# EAGLE design shématic (EAGLE 9.5.2)
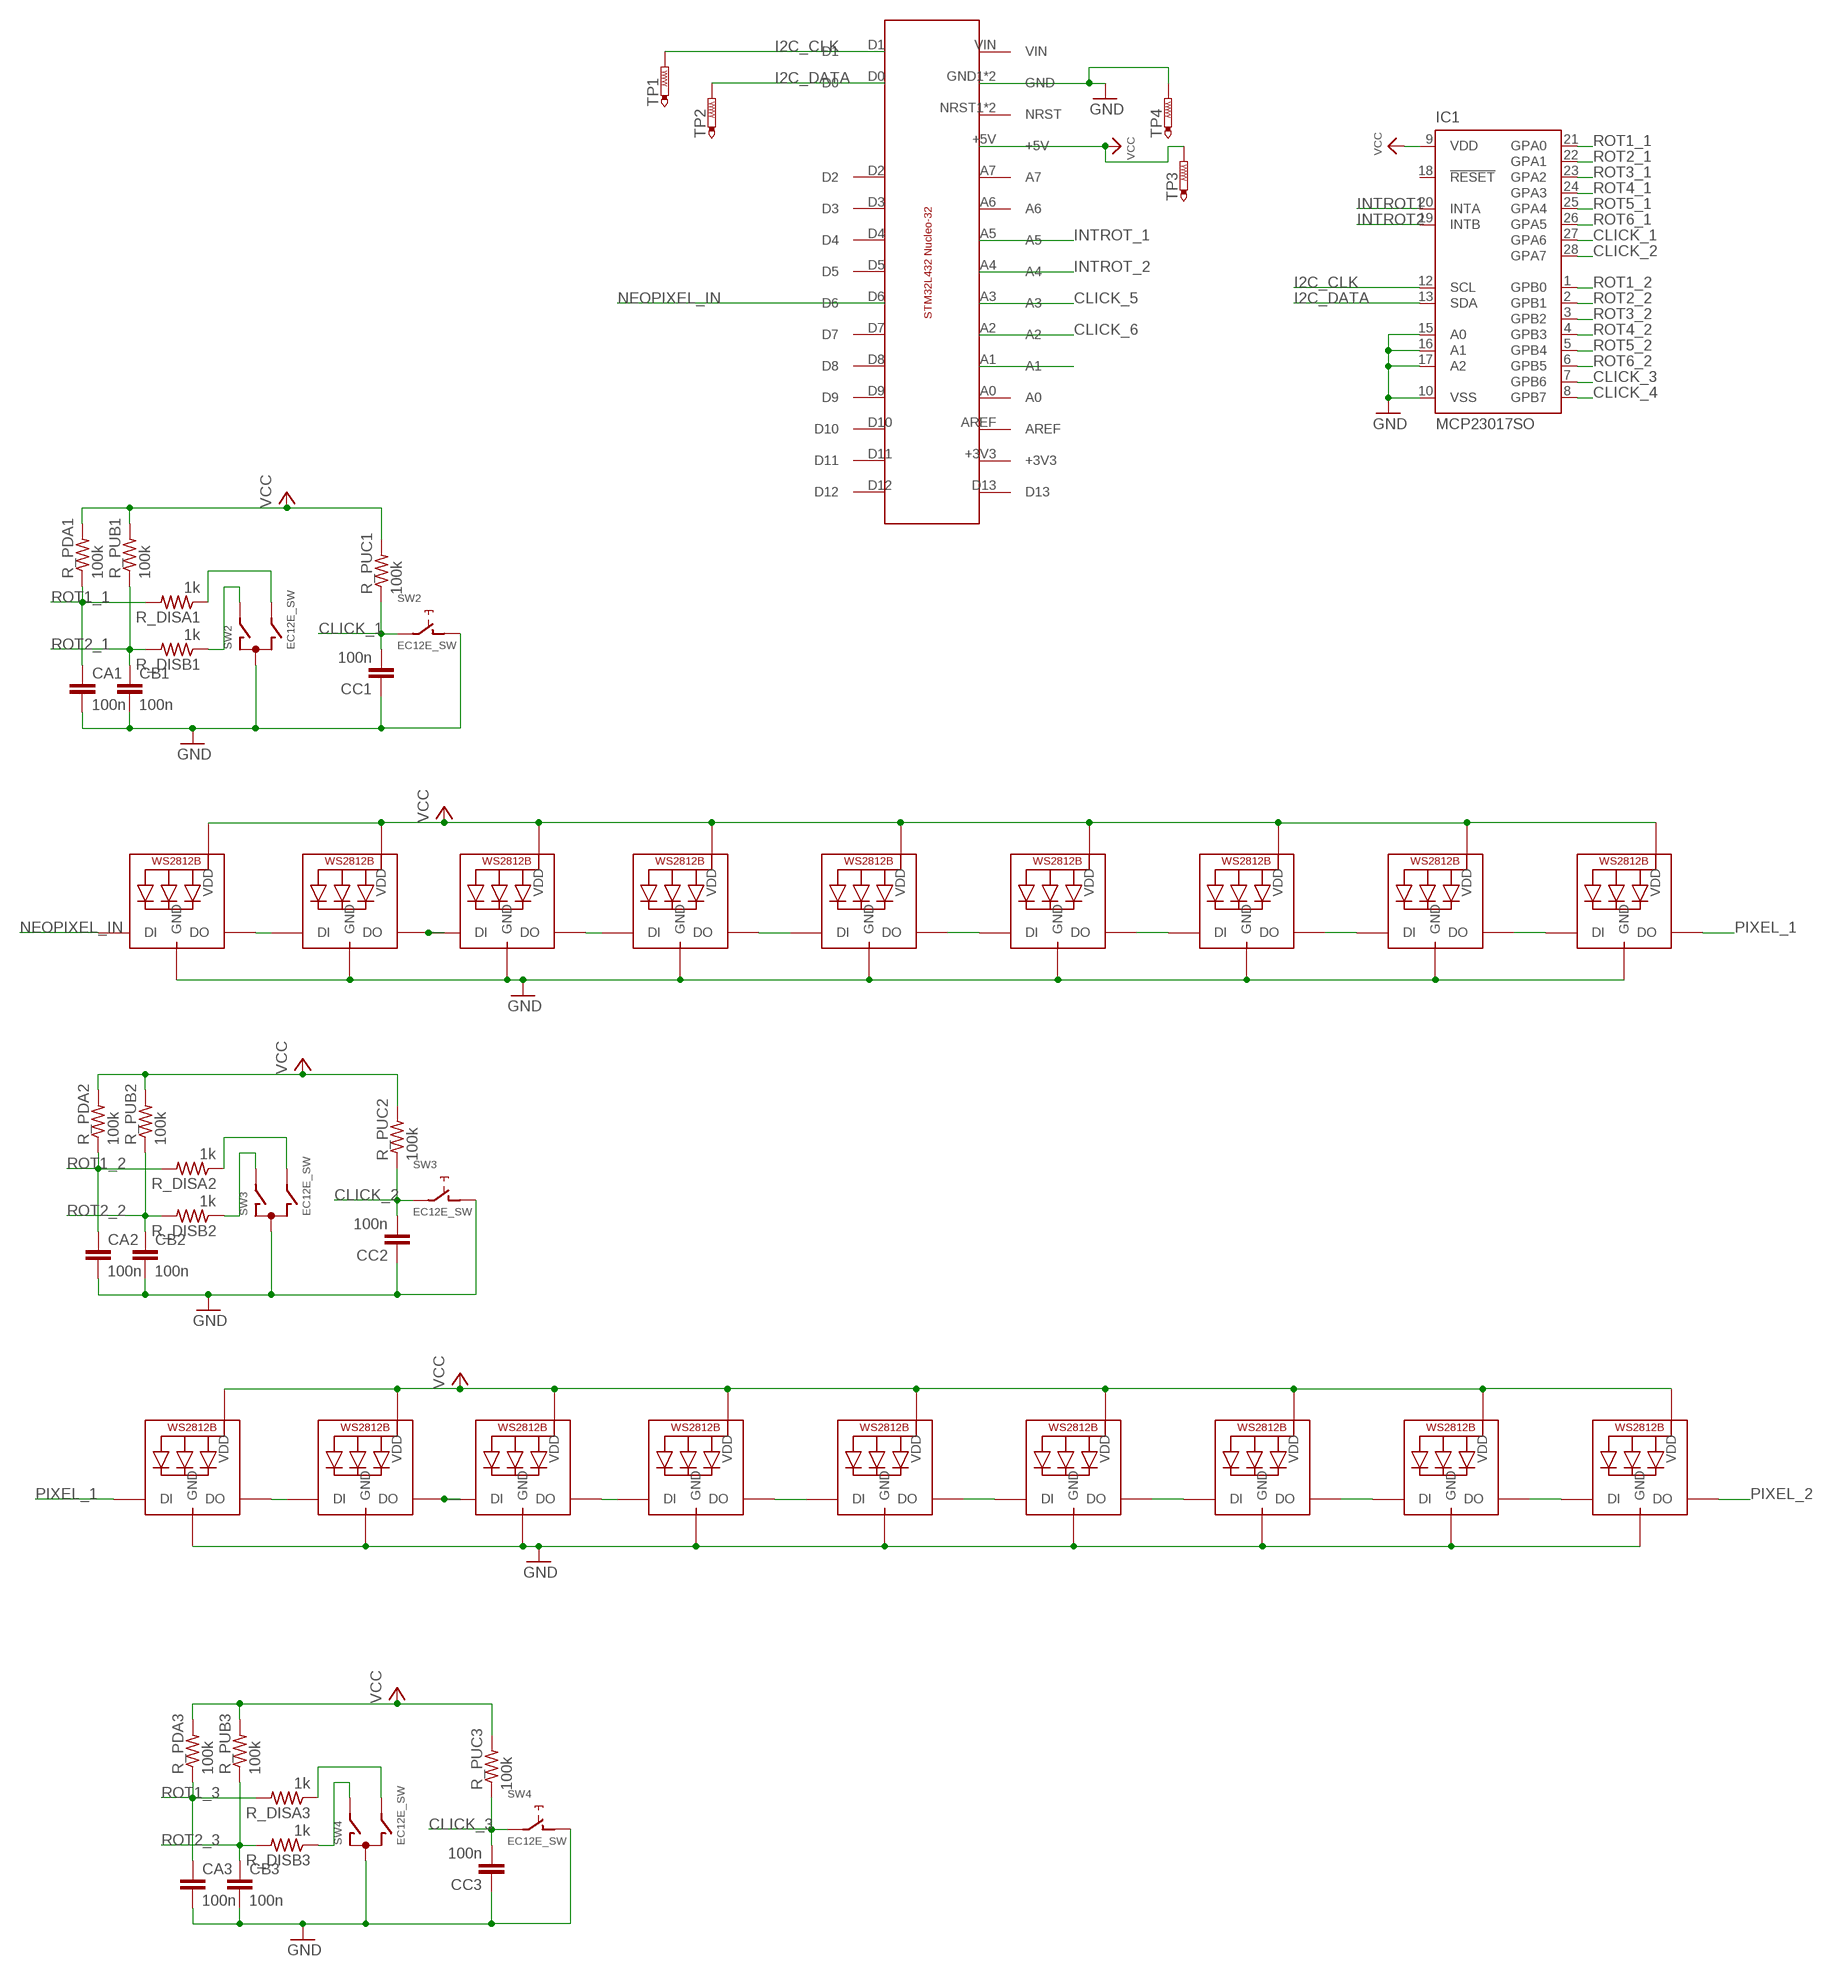
[diagram p0: schematic, sheet 1, part 1 of 2]
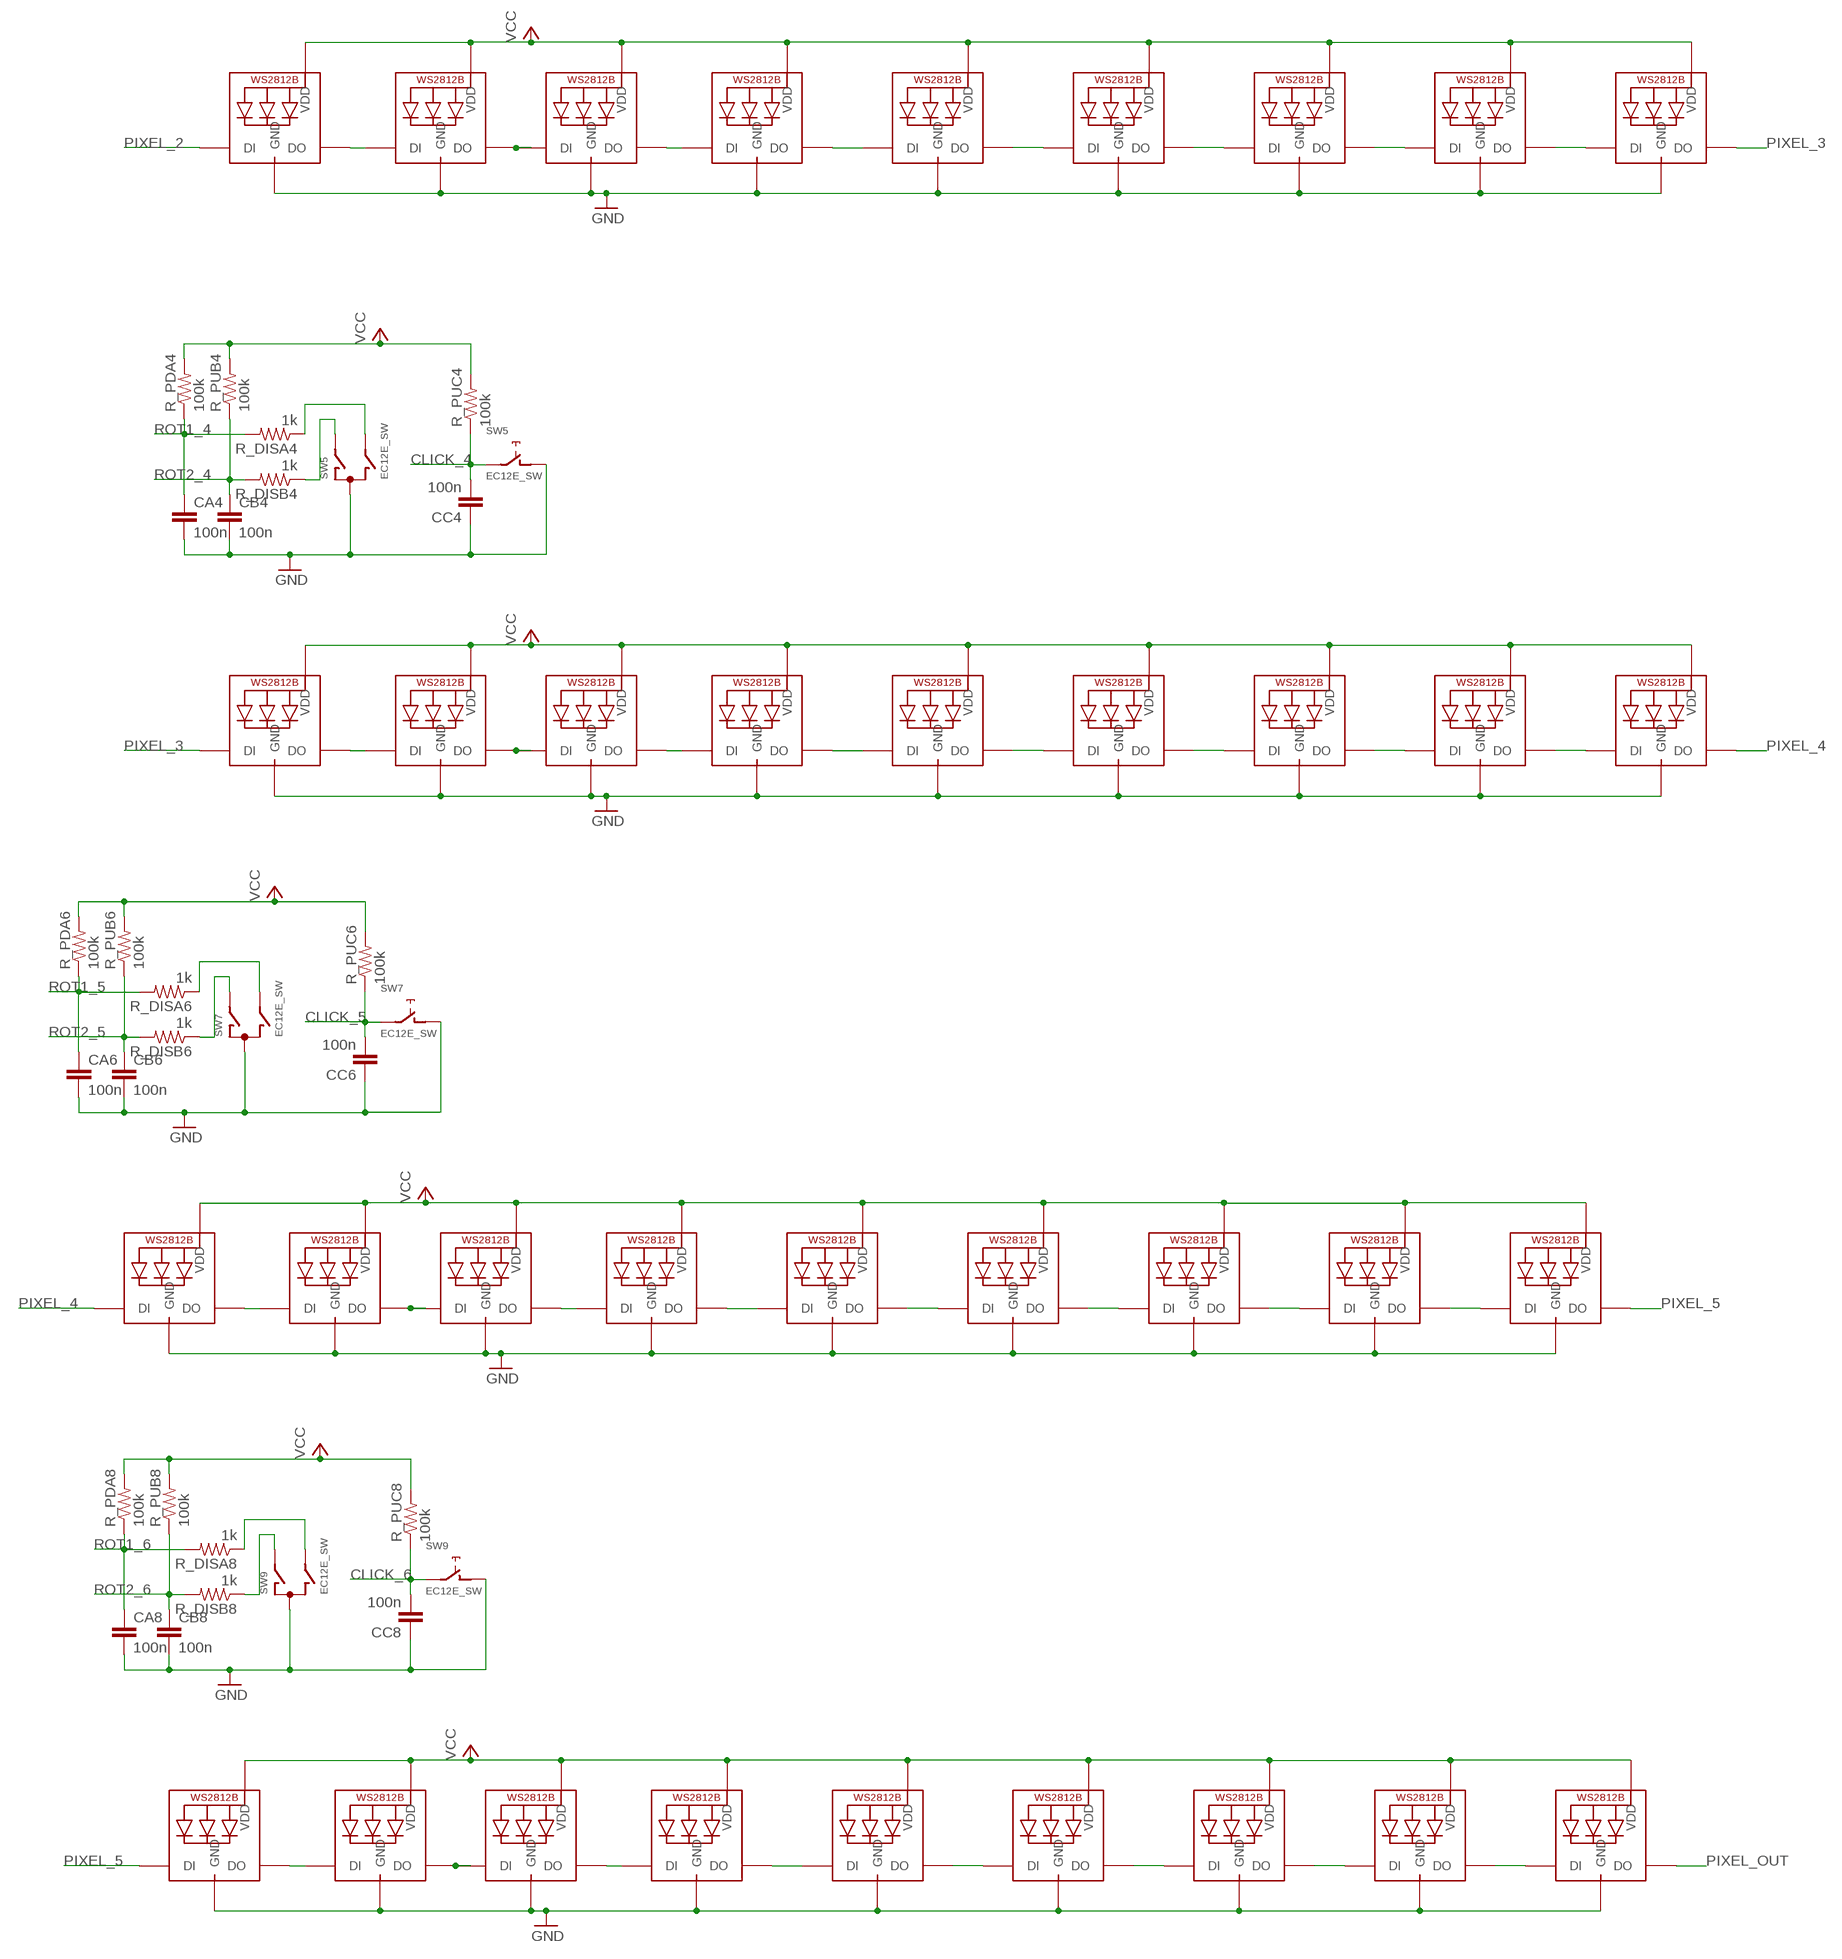
[diagram p1: schematic, sheet 1, part 2 of 2]

## Parts
CA1  100n  C-EUC1210  [C1210]
CA2  100n  C-EUC1210  [C1210]
CA3  100n  C-EUC1210  [C1210]
CA4  100n  C-EUC1210  [C1210]
CA6  100n  C-EUC1210  [C1210]
CA8  100n  C-EUC1210  [C1210]
CB1  100n  C-EUC1210  [C1210]
CB2  100n  C-EUC1210  [C1210]
CB3  100n  C-EUC1210  [C1210]
CB4  100n  C-EUC1210  [C1210]
CB6  100n  C-EUC1210  [C1210]
CB8  100n  C-EUC1210  [C1210]
CC1  100n  C-EUC1210  [C1210]
CC2  100n  C-EUC1210  [C1210]
CC3  100n  C-EUC1210  [C1210]
CC4  100n  C-EUC1210  [C1210]
CC6  100n  C-EUC1210  [C1210]
CC8  100n  C-EUC1210  [C1210]
IC1  MCP23017SO  [SO28W]
LED10  WS2812B5050  [WS2812B]
LED11  WS2812B5050  [WS2812B]
LED12  WS2812B5050  [WS2812B]
LED13  WS2812B5050  [WS2812B]
LED14  WS2812B5050  [WS2812B]
LED15  WS2812B5050  [WS2812B]
LED16  WS2812B5050  [WS2812B]
LED17  WS2812B5050  [WS2812B]
LED18  WS2812B5050  [WS2812B]
LED19  WS2812B5050  [WS2812B]
LED20  WS2812B5050  [WS2812B]
LED21  WS2812B5050  [WS2812B]
LED22  WS2812B5050  [WS2812B]
LED23  WS2812B5050  [WS2812B]
LED24  WS2812B5050  [WS2812B]
LED25  WS2812B5050  [WS2812B]
LED26  WS2812B5050  [WS2812B]
LED27  WS2812B5050  [WS2812B]
LED28  WS2812B5050  [WS2812B]
LED29  WS2812B5050  [WS2812B]
LED30  WS2812B5050  [WS2812B]
LED31  WS2812B5050  [WS2812B]
LED32  WS2812B5050  [WS2812B]
LED33  WS2812B5050  [WS2812B]
LED34  WS2812B5050  [WS2812B]
LED35  WS2812B5050  [WS2812B]
LED36  WS2812B5050  [WS2812B]
LED37  WS2812B5050  [WS2812B]
LED38  WS2812B5050  [WS2812B]
LED39  WS2812B5050  [WS2812B]
LED40  WS2812B5050  [WS2812B]
LED41  WS2812B5050  [WS2812B]
LED42  WS2812B5050  [WS2812B]
LED43  WS2812B5050  [WS2812B]
LED44  WS2812B5050  [WS2812B]
LED45  WS2812B5050  [WS2812B]
LED55  WS2812B5050  [WS2812B]
LED56  WS2812B5050  [WS2812B]
LED57  WS2812B5050  [WS2812B]
LED58  WS2812B5050  [WS2812B]
LED59  WS2812B5050  [WS2812B]
LED60  WS2812B5050  [WS2812B]
LED61  WS2812B5050  [WS2812B]
LED62  WS2812B5050  [WS2812B]
LED63  WS2812B5050  [WS2812B]
LED73  WS2812B5050  [WS2812B]
LED74  WS2812B5050  [WS2812B]
LED75  WS2812B5050  [WS2812B]
LED76  WS2812B5050  [WS2812B]
LED77  WS2812B5050  [WS2812B]
LED78  WS2812B5050  [WS2812B]
LED79  WS2812B5050  [WS2812B]
LED80  WS2812B5050  [WS2812B]
LED81  WS2812B5050  [WS2812B]
R_DISA1  1k  R-US_R1210  [R1210]
R_DISA2  1k  R-US_R1210  [R1210]
R_DISA3  1k  R-US_R1210  [R1210]
R_DISA4  1k  R-US_R1210  [R1210]
R_DISA6  1k  R-US_R1210  [R1210]
R_DISA8  1k  R-US_R1210  [R1210]
R_DISB1  1k  R-US_R1210  [R1210]
R_DISB2  1k  R-US_R1210  [R1210]
R_DISB3  1k  R-US_R1210  [R1210]
R_DISB4  1k  R-US_R1210  [R1210]
R_DISB6  1k  R-US_R1210  [R1210]
R_DISB8  1k  R-US_R1210  [R1210]
R_PDA1  100k  R-US_R1210  [R1210]
R_PDA2  100k  R-US_R1210  [R1210]
R_PDA3  100k  R-US_R1210  [R1210]
R_PDA4  100k  R-US_R1210  [R1210]
R_PDA6  100k  R-US_R1210  [R1210]
R_PDA8  100k  R-US_R1210  [R1210]
R_PUB1  100k  R-US_R1210  [R1210]
R_PUB2  100k  R-US_R1210  [R1210]
R_PUB3  100k  R-US_R1210  [R1210]
R_PUB4  100k  R-US_R1210  [R1210]
R_PUB6  100k  R-US_R1210  [R1210]
R_PUB8  100k  R-US_R1210  [R1210]
R_PUC1  100k  R-US_R1210  [R1210]
R_PUC2  100k  R-US_R1210  [R1210]
R_PUC3  100k  R-US_R1210  [R1210]
R_PUC4  100k  R-US_R1210  [R1210]
R_PUC6  100k  R-US_R1210  [R1210]
R_PUC8  100k  R-US_R1210  [R1210]
SW2  EC12E_SW  [ALPS_EC12E_SW]
SW3  EC12E_SW  [ALPS_EC12E_SW]
SW4  EC12E_SW  [ALPS_EC12E_SW]
SW5  EC12E_SW  [ALPS_EC12E_SW]
SW7  EC12E_SW  [ALPS_EC12E_SW]
SW9  EC12E_SW  [ALPS_EC12E_SW]
TP1  PTR1PAD1-13Y  [P1-13Y]
TP2  PTR1PAD1-13Y  [P1-13Y]
TP3  PTR1PAD1-13Y  [P1-13Y]
TP4  PTR1PAD1-13Y  [P1-13Y]
U$2  NUCLEO-HEADER  [NUCLEO-HEADER]

## Nets
CLICK_1: CC1.2 IC1.27(GPA6) R_PUC1.1 SW2.E
CLICK_2: CC2.2 IC1.28(GPA7) R_PUC2.1 SW3.E
CLICK_3: CC3.2 IC1.7(GPB6) R_PUC3.1 SW4.E
CLICK_4: CC4.2 IC1.8(GPB7) R_PUC4.1 SW5.E
CLICK_5: CC6.2 R_PUC6.1 SW7.E U$2.A3
CLICK_6: CC8.2 R_PUC8.1 SW9.E U$2.A2
GND: CA1.2 CA2.2 CA3.2 CA4.2 CA6.2 CA8.2 CB1.2 CB2.2 CB3.2 CB4.2 CB6.2 CB8.2 CC1.1 CC2.1 CC3.1 CC4.1 CC6.1 CC8.1 IC1.10(VSS) IC1.15(A0) IC1.16(A1) IC1.17(A2) LED10.3-GND(GND) LED11.3-GND(GND) LED12.3-GND(GND) LED13.3-GND(GND) LED14.3-GND(GND) LED15.3-GND(GND) LED16.3-GND(GND) LED17.3-GND(GND) LED18.3-GND(GND) LED19.3-GND(GND) LED20.3-GND(GND) LED21.3-GND(GND) LED22.3-GND(GND) LED23.3-GND(GND) LED24.3-GND(GND) LED25.3-GND(GND) LED26.3-GND(GND) LED27.3-GND(GND) LED28.3-GND(GND) LED29.3-GND(GND) LED30.3-GND(GND) LED31.3-GND(GND) LED32.3-GND(GND) LED33.3-GND(GND) LED34.3-GND(GND) LED35.3-GND(GND) LED36.3-GND(GND) LED37.3-GND(GND) LED38.3-GND(GND) LED39.3-GND(GND) LED40.3-GND(GND) LED41.3-GND(GND) LED42.3-GND(GND) LED43.3-GND(GND) LED44.3-GND(GND) LED45.3-GND(GND) LED55.3-GND(GND) LED56.3-GND(GND) LED57.3-GND(GND) LED58.3-GND(GND) LED59.3-GND(GND) LED60.3-GND(GND) LED61.3-GND(GND) LED62.3-GND(GND) LED63.3-GND(GND) LED73.3-GND(GND) LED74.3-GND(GND) LED75.3-GND(GND) LED76.3-GND(GND) LED77.3-GND(GND) LED78.3-GND(GND) LED79.3-GND(GND) LED80.3-GND(GND) LED81.3-GND(GND) SW2.C SW2.D SW3.C SW3.D SW4.C SW4.D SW5.C SW5.D SW7.C SW7.D SW9.C SW9.D TP4.TP U$2.GND1(GND) U$2.GND2(GND)
I2C_CLK: IC1.12(SCL) TP1.TP U$2.D1
I2C_DATA: IC1.13(SDA) TP2.TP U$2.D0
INTROT1: IC1.20(INTA)
INTROT2: IC1.19(INTB)
INTROT_1: U$2.A5
INTROT_2: U$2.A4
N$3: U$2.A1
N$6: LED10.2-DOUT(DO) LED11.4-DIN(DI)
N$11: LED11.2-DOUT(DO) LED12.4-DIN(DI)
N$12: LED12.2-DOUT(DO) LED13.4-DIN(DI)
N$13: LED13.2-DOUT(DO) LED14.4-DIN(DI)
N$16: R_DISB1.1 SW2.A
N$17: R_DISA1.1 SW2.B
N$18: LED17.2-DOUT(DO) LED18.4-DIN(DI)
N$19: LED16.2-DOUT(DO) LED17.4-DIN(DI)
N$20: LED15.2-DOUT(DO) LED16.4-DIN(DI)
N$21: LED14.2-DOUT(DO) LED15.4-DIN(DI)
N$22: LED19.2-DOUT(DO) LED20.4-DIN(DI)
N$23: LED20.2-DOUT(DO) LED21.4-DIN(DI)
N$24: LED21.2-DOUT(DO) LED22.4-DIN(DI)
N$25: LED22.2-DOUT(DO) LED23.4-DIN(DI)
N$26: R_DISB2.1 SW3.A
N$27: R_DISA2.1 SW3.B
N$28: LED26.2-DOUT(DO) LED27.4-DIN(DI)
N$29: LED25.2-DOUT(DO) LED26.4-DIN(DI)
N$30: LED24.2-DOUT(DO) LED25.4-DIN(DI)
N$31: LED23.2-DOUT(DO) LED24.4-DIN(DI)
N$32: LED28.2-DOUT(DO) LED29.4-DIN(DI)
N$33: LED29.2-DOUT(DO) LED30.4-DIN(DI)
N$34: LED30.2-DOUT(DO) LED31.4-DIN(DI)
N$35: LED31.2-DOUT(DO) LED32.4-DIN(DI)
N$36: R_DISB3.1 SW4.A
N$37: R_DISA3.1 SW4.B
N$38: LED35.2-DOUT(DO) LED36.4-DIN(DI)
N$39: LED34.2-DOUT(DO) LED35.4-DIN(DI)
N$40: LED33.2-DOUT(DO) LED34.4-DIN(DI)
N$41: LED32.2-DOUT(DO) LED33.4-DIN(DI)
N$42: LED37.2-DOUT(DO) LED38.4-DIN(DI)
N$43: LED38.2-DOUT(DO) LED39.4-DIN(DI)
N$44: LED39.2-DOUT(DO) LED40.4-DIN(DI)
N$45: LED40.2-DOUT(DO) LED41.4-DIN(DI)
N$46: R_DISB4.1 SW5.A
N$47: R_DISA4.1 SW5.B
N$48: LED44.2-DOUT(DO) LED45.4-DIN(DI)
N$49: LED43.2-DOUT(DO) LED44.4-DIN(DI)
N$50: LED42.2-DOUT(DO) LED43.4-DIN(DI)
N$51: LED41.2-DOUT(DO) LED42.4-DIN(DI)
N$62: LED55.2-DOUT(DO) LED56.4-DIN(DI)
N$63: LED56.2-DOUT(DO) LED57.4-DIN(DI)
N$64: LED57.2-DOUT(DO) LED58.4-DIN(DI)
N$65: LED58.2-DOUT(DO) LED59.4-DIN(DI)
N$66: R_DISB6.1 SW7.A
N$67: R_DISA6.1 SW7.B
N$68: LED62.2-DOUT(DO) LED63.4-DIN(DI)
N$69: LED61.2-DOUT(DO) LED62.4-DIN(DI)
N$70: LED60.2-DOUT(DO) LED61.4-DIN(DI)
N$71: LED59.2-DOUT(DO) LED60.4-DIN(DI)
N$82: LED73.2-DOUT(DO) LED74.4-DIN(DI)
N$83: LED74.2-DOUT(DO) LED75.4-DIN(DI)
N$84: LED75.2-DOUT(DO) LED76.4-DIN(DI)
N$85: LED76.2-DOUT(DO) LED77.4-DIN(DI)
N$86: R_DISB8.1 SW9.A
N$87: R_DISA8.1 SW9.B
N$88: LED80.2-DOUT(DO) LED81.4-DIN(DI)
N$89: LED79.2-DOUT(DO) LED80.4-DIN(DI)
N$90: LED78.2-DOUT(DO) LED79.4-DIN(DI)
N$91: LED77.2-DOUT(DO) LED78.4-DIN(DI)
NEOPIXEL_IN: LED10.4-DIN(DI) U$2.D6
PIXEL_1: LED18.2-DOUT(DO) LED19.4-DIN(DI)
PIXEL_2: LED27.2-DOUT(DO) LED28.4-DIN(DI)
PIXEL_3: LED36.2-DOUT(DO) LED37.4-DIN(DI)
PIXEL_4: LED45.2-DOUT(DO) LED55.4-DIN(DI)
PIXEL_5: LED63.2-DOUT(DO) LED73.4-DIN(DI)
PIXEL_OUT: LED81.2-DOUT(DO)
ROT1_1: CA1.1 IC1.21(GPA0) R_DISA1.2 R_PDA1.1
ROT1_2: CA2.1 IC1.1(GPB0) R_DISA2.2 R_PDA2.1
ROT1_3: CA3.1 R_DISA3.2 R_PDA3.1
ROT1_4: CA4.1 R_DISA4.2 R_PDA4.1
ROT1_5: CA6.1 R_DISA6.2 R_PDA6.1
ROT1_6: CA8.1 R_DISA8.2 R_PDA8.1
ROT2_1: CB1.1 IC1.22(GPA1) R_DISB1.2 R_PUB1.1
ROT2_2: CB2.1 IC1.2(GPB1) R_DISB2.2 R_PUB2.1
ROT2_3: CB3.1 R_DISB3.2 R_PUB3.1
ROT2_4: CB4.1 R_DISB4.2 R_PUB4.1
ROT2_5: CB6.1 R_DISB6.2 R_PUB6.1
ROT2_6: CB8.1 R_DISB8.2 R_PUB8.1
ROT3_1: IC1.23(GPA2)
ROT3_2: IC1.3(GPB2)
ROT4_1: IC1.24(GPA3)
ROT4_2: IC1.4(GPB3)
ROT5_1: IC1.25(GPA4)
ROT5_2: IC1.5(GPB4)
ROT6_1: IC1.26(GPA5)
ROT6_2: IC1.6(GPB5)
VCC: IC1.9(VDD) LED10.1-VDD(VDD) LED11.1-VDD(VDD) LED12.1-VDD(VDD) LED13.1-VDD(VDD) LED14.1-VDD(VDD) LED15.1-VDD(VDD) LED16.1-VDD(VDD) LED17.1-VDD(VDD) LED18.1-VDD(VDD) LED19.1-VDD(VDD) LED20.1-VDD(VDD) LED21.1-VDD(VDD) LED22.1-VDD(VDD) LED23.1-VDD(VDD) LED24.1-VDD(VDD) LED25.1-VDD(VDD) LED26.1-VDD(VDD) LED27.1-VDD(VDD) LED28.1-VDD(VDD) LED29.1-VDD(VDD) LED30.1-VDD(VDD) LED31.1-VDD(VDD) LED32.1-VDD(VDD) LED33.1-VDD(VDD) LED34.1-VDD(VDD) LED35.1-VDD(VDD) LED36.1-VDD(VDD) LED37.1-VDD(VDD) LED38.1-VDD(VDD) LED39.1-VDD(VDD) LED40.1-VDD(VDD) LED41.1-VDD(VDD) LED42.1-VDD(VDD) LED43.1-VDD(VDD) LED44.1-VDD(VDD) LED45.1-VDD(VDD) LED55.1-VDD(VDD) LED56.1-VDD(VDD) LED57.1-VDD(VDD) LED58.1-VDD(VDD) LED59.1-VDD(VDD) LED60.1-VDD(VDD) LED61.1-VDD(VDD) LED62.1-VDD(VDD) LED63.1-VDD(VDD) LED73.1-VDD(VDD) LED74.1-VDD(VDD) LED75.1-VDD(VDD) LED76.1-VDD(VDD) LED77.1-VDD(VDD) LED78.1-VDD(VDD) LED79.1-VDD(VDD) LED80.1-VDD(VDD) LED81.1-VDD(VDD) R_PDA1.2 R_PDA2.2 R_PDA3.2 R_PDA4.2 R_PDA6.2 R_PDA8.2 R_PUB1.2 R_PUB2.2 R_PUB3.2 R_PUB4.2 R_PUB6.2 R_PUB8.2 R_PUC1.2 R_PUC2.2 R_PUC3.2 R_PUC4.2 R_PUC6.2 R_PUC8.2 TP3.TP U$2.+5V
Unconnected: IC1.18(!RESET) SW2.GND1(G) SW2.GND2(G) SW3.GND1(G) SW3.GND2(G) SW4.GND1(G) SW4.GND2(G) SW5.GND1(G) SW5.GND2(G) SW7.GND1(G) SW7.GND2(G) SW9.GND1(G) SW9.GND2(G) U$2.+3V3 U$2.A0 U$2.A6 U$2.A7 U$2.AREF U$2.D2 U$2.D3 U$2.D4 U$2.D5 U$2.D7 U$2.D8 U$2.D9 U$2.D10 U$2.D11 U$2.D12 U$2.D13 U$2.NRST1(NRST) U$2.NRST2(NRST) U$2.VIN

## Library data of the parts
CA1-CA4 CA6 CA8 CB1-CB4 CB6 CB8 CC1-CC4 CC6 CC8 = rcl:C-EU: CAPACITOR, European symbol; SPICEPREFIX: C
IC1 = microchip:MCP23017: http://ww1.microchip.com/downloads/en/DeviceDoc/21952a.pdf Source: http://ww1.microchip.com/downloads/en/DeviceDoc/21952a.pdf; MF: MICROCHIP; MPN: MCP23017-E/SO; OC_FARNELL: 1332087; OC_NEWARK: 31K2958
LED10-LED45 LED55-LED63 LED73-LED81 = WS2812B:WS2812B; AVAILABILITY: Unavailable; DESCRIPTION: Raspberry Pi HAT _40 pin_ Wheeled Robotics Kit; MF: SparkFun Electronics; MP: WS2812B; PACKAGE: None; PRICE: None
R_DISA1-R_DISA4 R_DISA6 R_DISA8 R_DISB1-R_DISB4 R_DISB6 R_DISB8 R_PDA1-R_PDA4 R_PDA6 R_PDA8 R_PUB1-R_PUB4 R_PUB6 R_PUB8 R_PUC1-R_PUC4 R_PUC6 R_PUC8 = rcl:R-US_: RESISTOR, American symbol; SPICEPREFIX: R
SW2-SW5 SW7 SW9 = switch-alps:EC12E_SW: ALPS rotary Encoder EC12E series with switch; MPN: EC12E2424407; OC_FARNELL: 1520813; OC_NEWARK: 74M1068
TP1-TP4 = testpad:PTR1: TEST PIN
U$2 = STM32L432-HEADER:NUCLEO-HEADER: STM32L432 A footprint for a header we plug the nucleo board into.

## Board
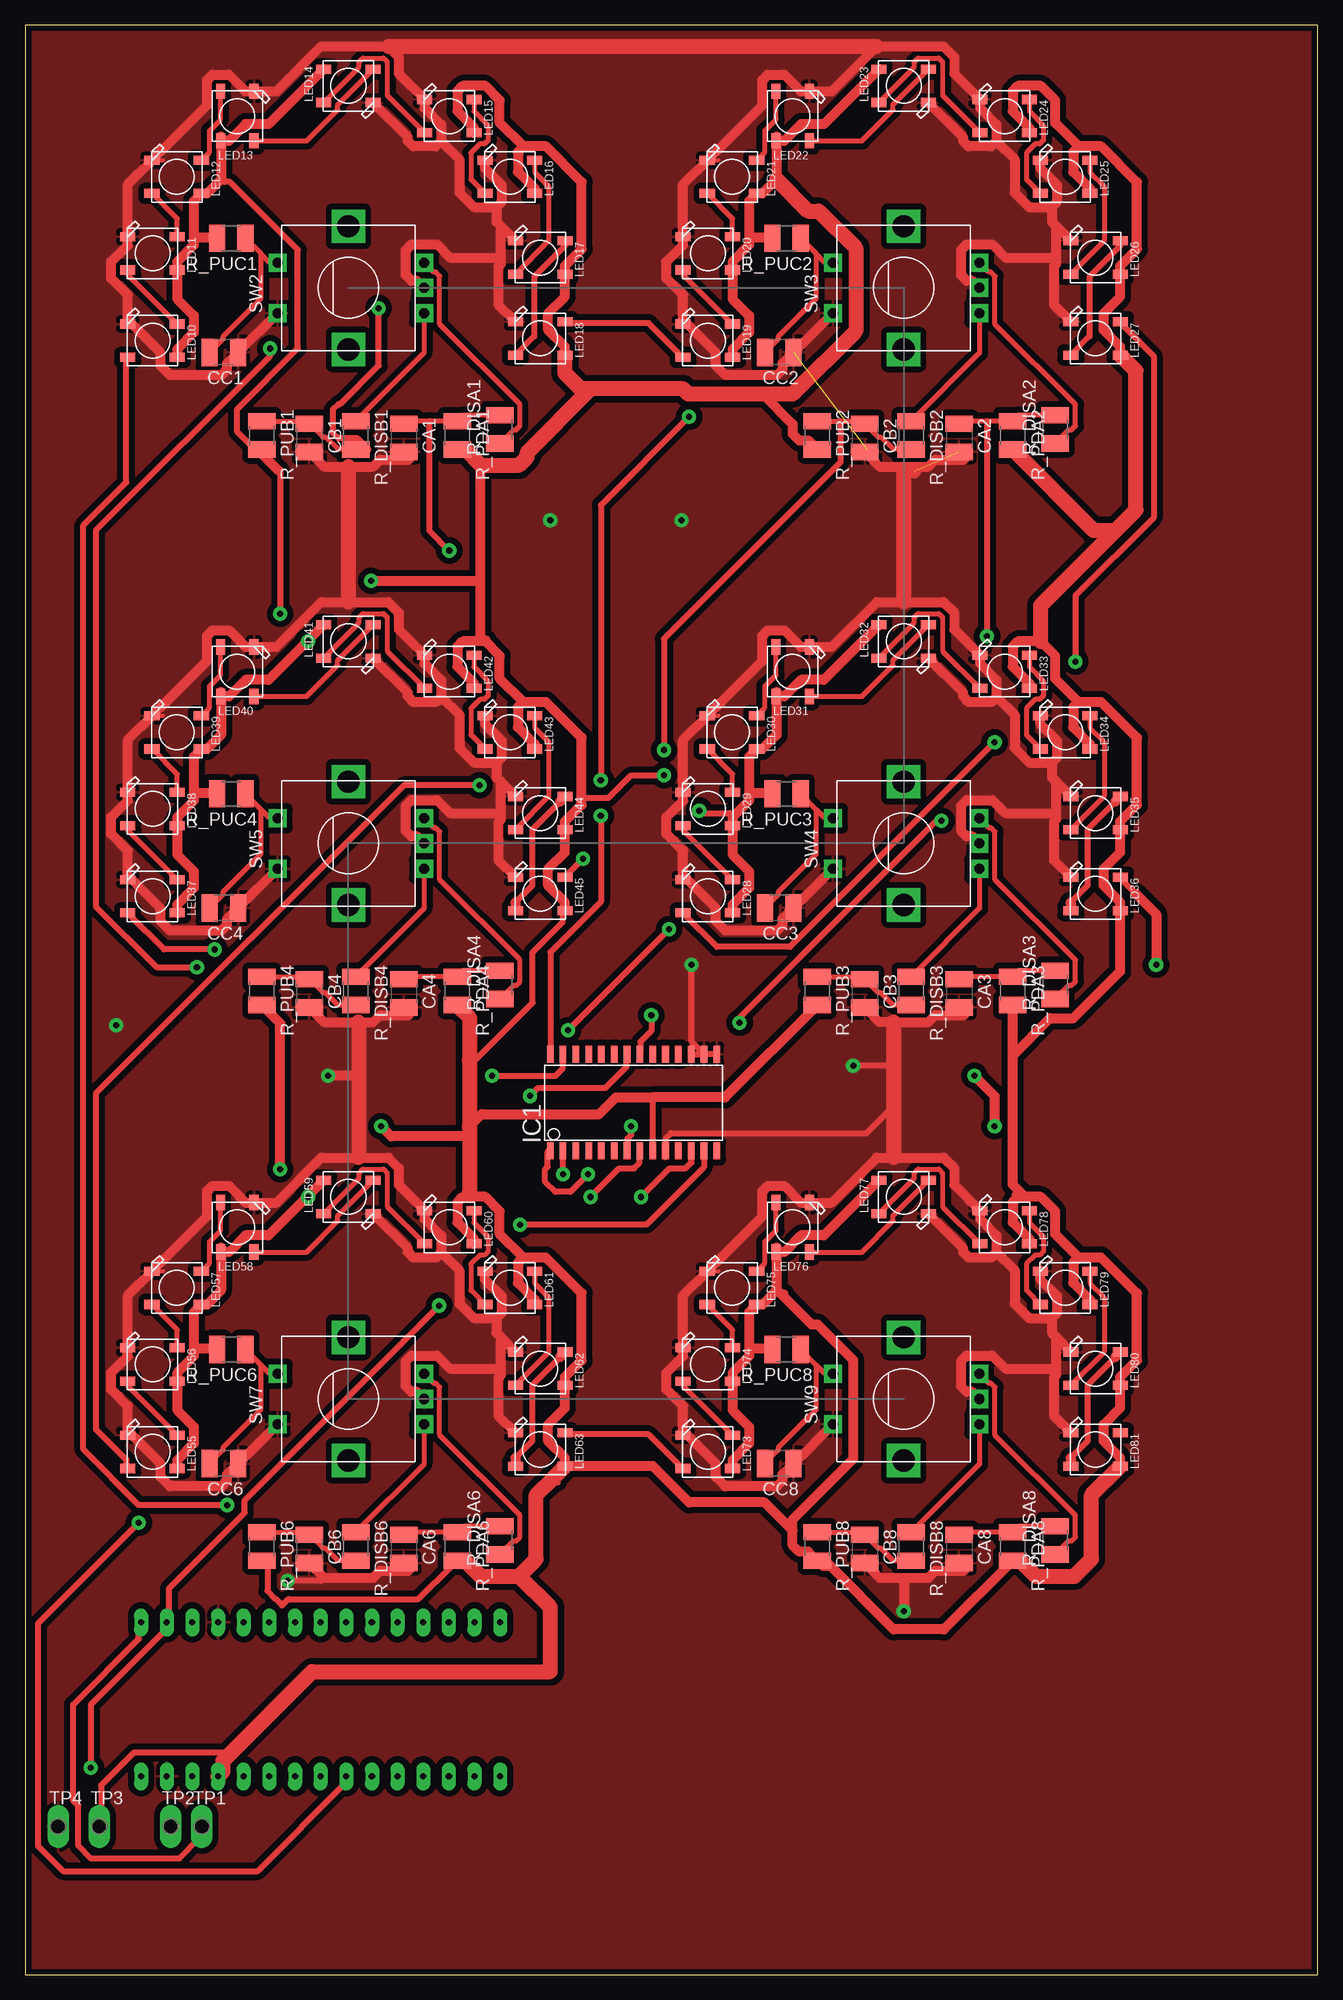
[diagram p2: board, top side]
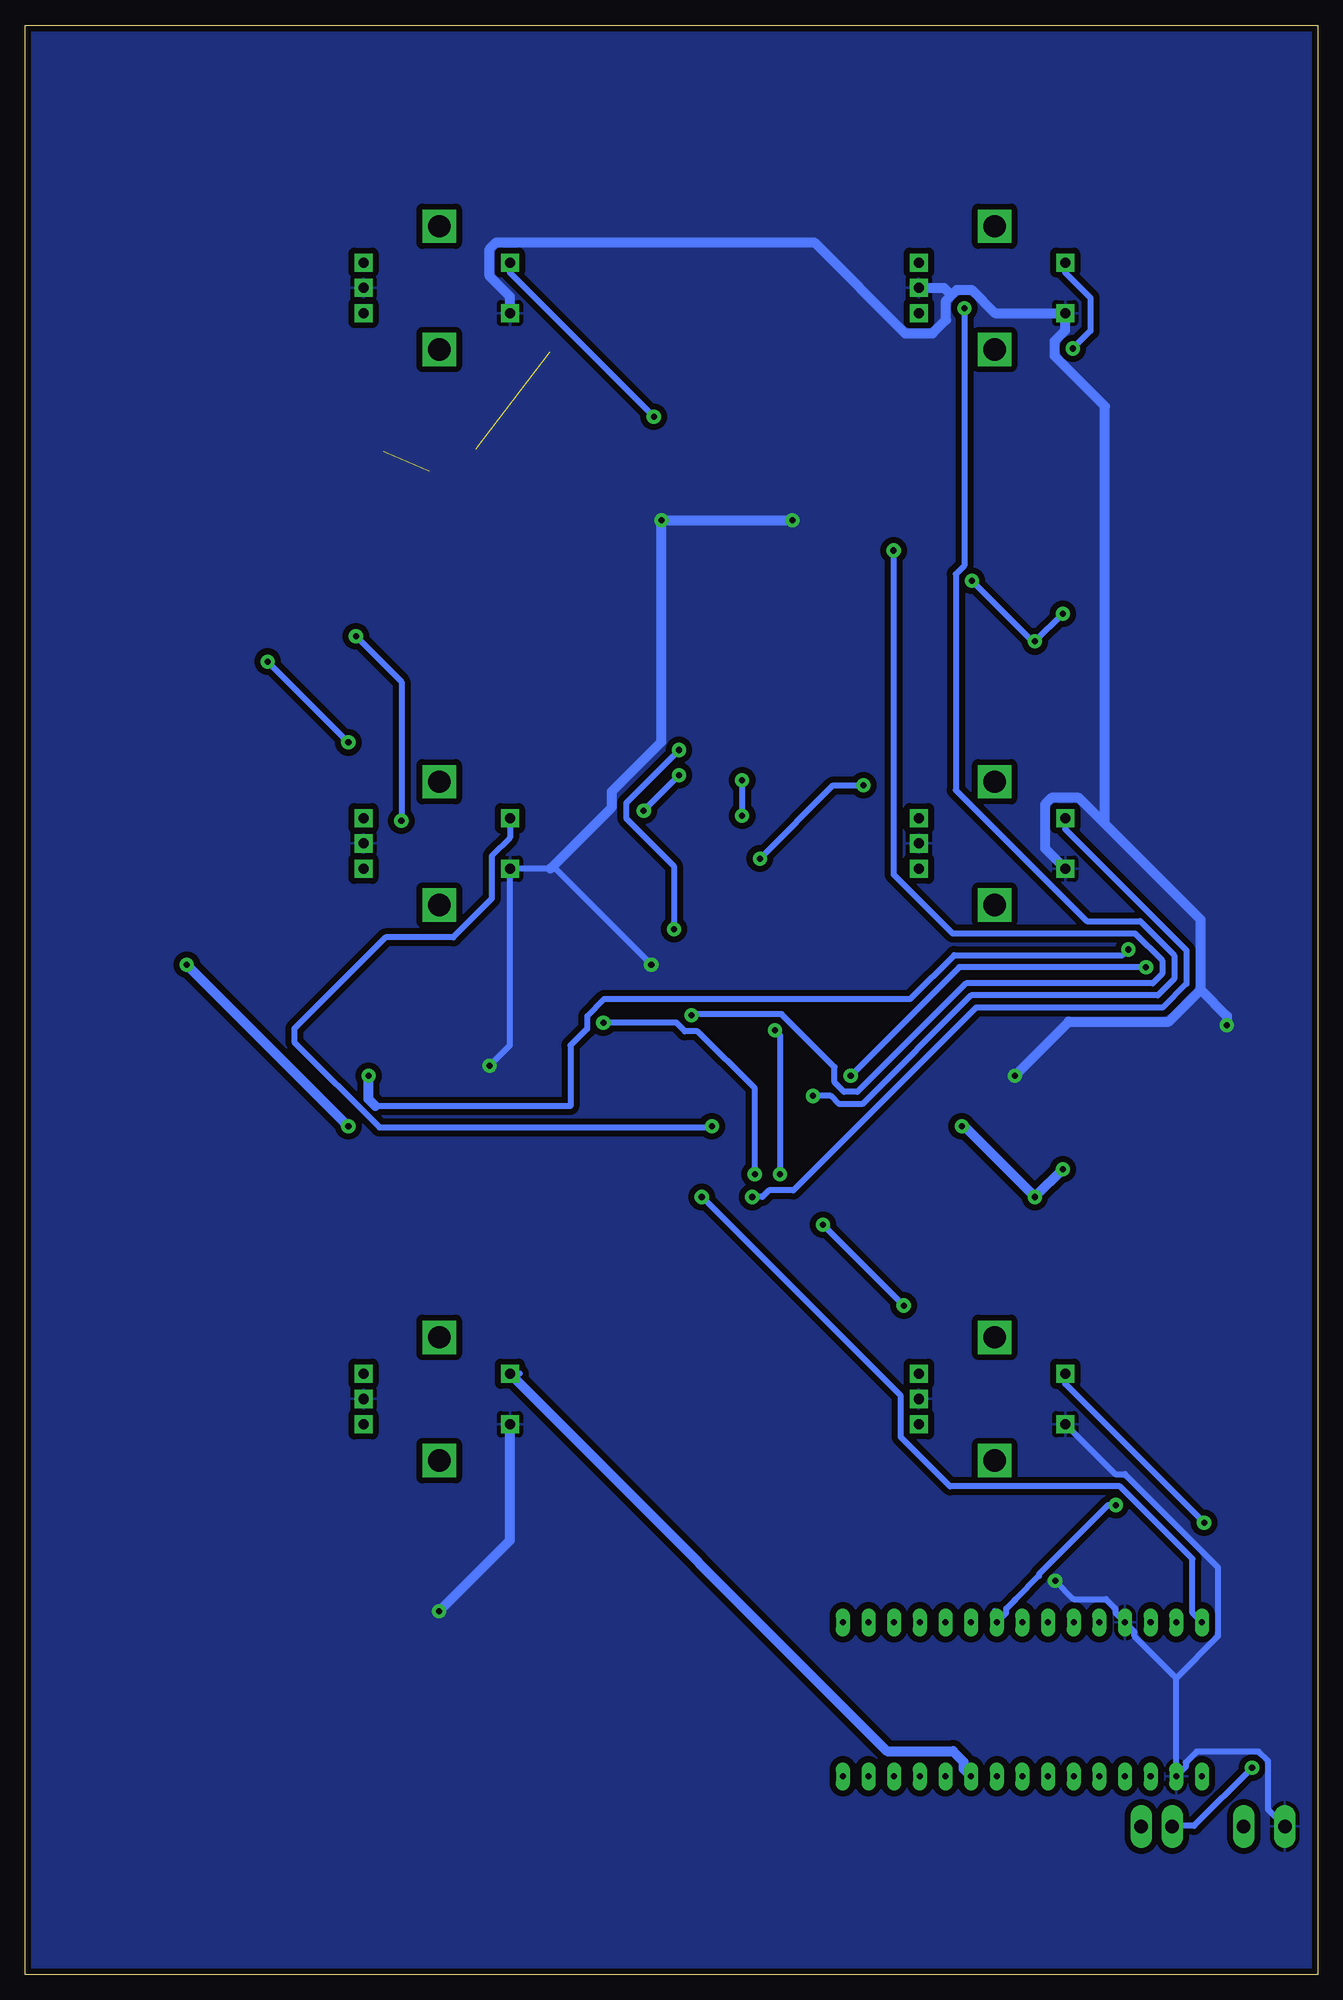
[diagram p3: board, bottom side, seen from below]

Size 128 x 193 mm. Coordinates in mm from the lower left corner, seen from the top.
Outline: 0,0 128,0 128,193 0,193 0,0
Copper layers (1*16): Top 0.035mm / dielectric 1.5mm / Bottom 0.035mm
Design rules "JLCPCB_2019 *": minimum track width 0.6mm, minimum drill 0.6mm, track to track 0.6mm, track to pad 0.6mm, pad to pad 0.6mm, via to via 0.6mm, smd to smd 0.6mm, copper to edge 0.6mm, drill to drill 0.6mm, minimum pad ring 0.4mm, minimum via ring 0.4mm, stop-mask expansion 4mil, vias tented up to drill 0mil, thermal gap 0.4mm

### Footprints (pad centres in the part's own frame; a part is rotated, then mirrored left to right if it is on the bottom)
C1210 = smd 1.6 x 2.7: 1 -1.4,0; 2 1.4,0
SO28W = smd 0.65 x 1.7: 1 -7.62,-4.78; 2 -6.35,-4.78; 3 -5.08,-4.78; 4 -3.81,-4.78; 5 -2.54,-4.78; 6 -1.27,-4.78; 7 0,-4.78; 8 1.27,-4.78; 9 2.54,-4.78; 10 3.81,-4.78; 11 5.08,-4.78; 12 6.35,-4.78; 13 7.62,-4.78; 14 8.89,-4.78; 15 8.89,4.78; 16 7.62,4.78; 17 6.35,4.78; 18 5.08,4.78; 19 3.81,4.78; 20 2.54,4.78; 21 1.27,4.78; 22 0,4.78; 23 -1.27,4.78; 24 -2.54,4.78; 25 -3.81,4.78; 26 -5.08,4.78; 27 -6.35,4.78; 28 -7.62,4.78
WS2812B = smd 1.5 x 0.9: 1-VDD 2.45,-1.65; 2-DOUT 2.45,1.65; 3-GND -2.45,1.65; 4-DIN -2.45,-1.65
R1210 = smd 1.6 x 2.7: 1 -1.4,0; 2 1.4,0
ALPS_EC12E_SW = drill 1 square: A -2.5,-7.5; B 2.5,-7.5; C 0,-7.5; D -2.5,7; E 2.5,7 | drill 2.2 square: GND1 -6.1,0; GND2 6.1,0
P1-13Y = drill 1.321 pad 1.905 long: TP 0,0
NUCLEO-HEADER = drill 0.6 long: +3V3 -15.24,0; +5V 10.16,0; A0 -10.16,0; A1 -7.62,0; A2 -5.08,0; A3 -2.54,0; A4 0,0; A5 2.54,0; A6 5.08,0; A7 7.62,0; AREF -12.7,0; D0 15.24,15.24; D1 17.78,15.24; D2 7.62,15.24; D3 5.08,15.24; D4 2.54,15.24; D5 0,15.24; D6 -2.54,15.24; D7 -5.08,15.24; D8 -7.62,15.24; D9 -10.16,15.24; D10 -12.7,15.24; D11 -15.24,15.24; D12 -17.78,15.24; D13 -17.78,0; GND1 15.24,0; GND2 10.16,15.24; NRST1 12.7,0; NRST2 12.7,15.24; VIN 17.78,0

### Placement (x,y rotation side)
CA1  37.49,152.16 270 top
CA2  92.49,152.16 270 top
CA3  92.49,97.16 270 top
CA4  37.49,97.16 270 top
CA6  37.49,42.16 270 top
CA8  92.49,42.16 270 top
CB1  28.14,152.16 270 top
CB2  83.14,152.16 270 top
CB3  83.14,97.16 270 top
CB4  28.14,97.16 270 top
CB6  28.14,42.16 270 top
CB8  83.14,42.16 270 top
CC1  19.67,160.61 180 top
CC2  74.67,160.61 180 top
CC3  74.67,105.61 180 top
CC4  19.67,105.61 180 top
CC6  19.67,50.61 180 top
CC8  74.67,50.61 180 top
IC1  59.6,86.35 0 top
LED10  12.6,161.77 0 top
LED11  12.6,170.42 0 top
LED12  15,178 0 top
LED13  21,184 270 top
LED14  32,187 180 top
LED15  42,184 0 top
LED16  48,178 0 top
LED17  51,170 0 top
LED18  51,162 0 top
LED19  67.6,161.77 0 top
LED20  67.6,170.42 0 top
LED21  70,178 0 top
LED22  76,184 270 top
LED23  87,187 180 top
LED24  97,184 0 top
LED25  103,178 0 top
LED26  106,170 0 top
LED27  106,162 0 top
LED28  67.6,106.77 0 top
LED29  67.6,115.42 0 top
LED30  70,123 0 top
LED31  76,129 270 top
LED32  87,132 180 top
LED33  97,129 0 top
LED34  103,123 0 top
LED35  106,115 0 top
LED36  106,107 0 top
LED37  12.6,106.77 0 top
LED38  12.6,115.42 0 top
LED39  15,123 0 top
LED40  21,129 270 top
LED41  32,132 180 top
LED42  42,129 0 top
LED43  48,123 0 top
LED44  51,115 0 top
LED45  51,107 0 top
LED55  12.6,51.77 0 top
LED56  12.6,60.42 0 top
LED57  15,68 0 top
LED58  21,74 270 top
LED59  32,77 180 top
LED60  42,74 0 top
LED61  48,68 0 top
LED62  51,60 0 top
LED63  51,52 0 top
LED73  67.6,51.77 0 top
LED74  67.6,60.42 0 top
LED75  70,68 0 top
LED76  76,74 270 top
LED77  87,77 180 top
LED78  97,74 0 top
LED79  103,68 0 top
LED80  106,60 0 top
LED81  106,52 0 top
R_DISA1  47,153 90 top
R_DISA2  102,153 90 top
R_DISA3  102,98 90 top
R_DISA4  47,98 90 top
R_DISA6  47,43 90 top
R_DISA8  102,43 90 top
R_DISB1  32.74,152.4 270 top
R_DISB2  87.74,152.4 270 top
R_DISB3  87.74,97.4 270 top
R_DISB4  32.74,97.4 270 top
R_DISB6  32.74,42.4 270 top
R_DISB8  87.74,42.4 270 top
R_PDA1  42.79,152.4 270 top
R_PDA2  97.79,152.4 270 top
R_PDA3  97.79,97.4 270 top
R_PDA4  42.79,97.4 270 top
R_PDA6  42.79,42.4 270 top
R_PDA8  97.79,42.4 270 top
R_PUB1  23.44,152.4 270 top
R_PUB2  78.44,152.4 270 top
R_PUB3  78.44,97.4 270 top
R_PUB4  23.44,97.4 270 top
R_PUB6  23.44,42.4 270 top
R_PUB8  78.44,42.4 270 top
R_PUC1  20.4,171.91 180 top
R_PUC2  75.4,171.91 180 top
R_PUC3  75.4,116.91 180 top
R_PUC4  20.4,116.91 180 top
R_PUC6  20.4,61.91 180 top
R_PUC8  75.4,61.91 180 top
SW2  32,167 90 top
SW3  87,167 90 top
SW4  87,112 90 top
SW5  32,112 90 top
SW7  32,57 90 top
SW9  87,57 90 top
TP1  17.49,14.69 0 top
TP2  14.41,14.69 0 top
TP3  7.33,14.69 0 top
TP4  3.25,14.69 0 top
U$2  29.25,19.64 0 bottom

### Tracks (layer width: path | path; a pad name or v marks a point on that pad's centre or on a via)
CLICK_1  (via drill 0.6)
  Top 0.5: SW2.E 24.21,169.5 23.36,170.36 | 23.36,170.36 R_PUC1.1 | CC1.2 19.62,161.96 19.62,162.23 23.36,165.96 23.36,170.36
  Top 0.6: IC1.27 53.25,89.75 52.5,89 v46.25,89 | v17,99.75 13,99.75 7,105.75 7,143 24.25,160.25 v24.25,161
  Bottom 0.6: v46.25,89 35.5,99.75 v17,99.75 | v24.25,161 22.5,162.75 22.5,166 25,168.5 SW2.E
CLICK_2  (via drill 0.6)
  Top 0.5: SW3.E 79.21,169.5 78.36,170.36 | 78.36,170.36 R_PUC2.1 | CC2.2 74.62,161.96 74.62,162.23 78.36,165.96 78.36,170.36
  Top 0.6: v57,114.75 57,106.25 52,101.25 52,91.25 IC1.28 | v57,118.25 57,145.5 v65.75,154.25
  Bottom 0.6: v57,118.25 v57,114.75 | v65.75,154.25 80,168.5 SW3.E
CLICK_3  (via drill 0.6)
  Top 0.5: SW4.E 79.21,114.5 78.36,115.36 | 78.36,115.36 R_PUC3.1 | CC3.2 74.62,106.96 74.62,107.23 78.36,110.96 78.36,115.36
  Top 0.6: v60,84 60,83.15 59.62,82.77 59.62,81.59 IC1.7
  Bottom 0.6: SW4.E 80,112.57 81.8,110.77 81.8,106.53 85.63,102.7 92.31,102.7 101.35,93.66 101.35,92.34 92.91,83.9 62.1,83.9 62,83.9 60.1,83.9 v60,84
CLICK_4  (via drill 0.6)
  Top 0.5: SW5.E 24.21,114.5 23.36,115.36 | 23.36,115.36 R_PUC4.1 | CC4.2 19.62,106.96 19.62,107.23 23.36,110.96 23.36,115.36
  Top 0.6: v56,77 58.82,79.82 60.3,79.82 60.83,80.35 60.83,81.53 IC1.8
  Bottom 0.6: SW5.E 25,113.41 13,101.41 13,98.09 15.34,95.75 33.84,95.75 51.94,77.65 54.35,77.65 55,77 v56,77
CLICK_5  (via drill 0.6)
  Top 0.5: SW7.E 24.21,59.5 23.36,60.35 | 23.36,60.35 R_PUC6.1 | CC6.2 19.62,51.96 19.62,52.23 23.36,55.96 23.36,60.35
  Top 0.6: v11.25,44.75 1.25,34.75 1.25,12.75 3.75,10.25 23,10.25 31.75,19 31.75,19.5 U$2.A3
  Bottom 0.6: v11.25,44.75 25,58.5 SW7.E
CLICK_6
  Top 0.5: SW9.E 79.21,59.5 78.36,60.35 | 78.36,60.35 R_PUC8.1 | CC8.2 74.62,51.96 74.62,52.23 78.36,55.96 78.36,60.35
  Bottom 0.6: SW9.E 79,59.5
  Bottom 1: SW9.E 42.64,22.14 36.12,22.14 35.07,21.09 35.07,20.38 U$2.A2
GND  (via drill 0.6)  (2 unrouted)
  Top 0.4: 9.8,172.07 LED11.3-GND | LED12.3-GND 13.65,179.65 | 28.38,151 CB1.2 | 64.8,172.07 LED20.3-GND | LED21.3-GND 68.65,179.65 | 83.38,151 CB2.2 | 64.8,117.07 LED29.3-GND | LED30.3-GND 68.65,124.65 | 83.38,96 CB3.2 | 9.8,117.07 LED38.3-GND | LED39.3-GND 13.65,124.65 | 28.38,96 CB4.2 | 9.8,62.07 LED56.3-GND | LED57.3-GND 13.65,69.65 | 28.38,41 CB6.2 | 64.8,62.07 LED74.3-GND | LED75.3-GND 68.65,69.65 | 83.38,41 CB8.2
  Top 0.5: 21.11,160.61 CC1.1 | 76.11,160.61 CC2.1 | 76.11,105.61 CC3.1 | 21.11,105.61 CC4.1 | 21.11,50.61 CC6.1 | 76.11,50.61 CC8.1
  Top 0.6: IC1.10 63.45,81.61 63.45,82.79 63.98,83.32 83.32,83.32 86,86 | IC1.17 IC1.16 | IC1.15 IC1.16 | IC1.16 66,92.35 v66,100 | 86,90 v82,90 | 29.6,39.3 29.3,39 v26,39
  Top 1: CC1.1 19.97,159.51 19.97,158.89 19.44,158.36 14.34,158.36 13.4,159.3 13.4,160.6 10.58,163.42 LED10.3-GND 10.15,166.3 8.5,167.95 8.5,169.59 10.15,171.24 LED11.3-GND 10.15,177.25 LED12.3-GND 18,185.1 18,187.57 18.53,188.1 20.17,188.1 21.82,186.45 LED13.3-GND 24.88,186.45 29.33,190.9 35.95,190.9 37,189.85 37,188.2 LED15.3-GND 39.55,184.82 41.2,183.17 41.2,181.53 | 41.2,181.53 40.67,181 38.43,181 37.9,181.53 37.9,181.9 LED14.3-GND | 46.67,175 44.43,175 43,176.43 43,179.73 41.2,181.53 | 46.67,175 47.2,175.53 47.2,177.17 45.55,178.82 LED16.3-GND | 46.67,175 46.67,173.53 47.1,173.1 | 47.1,173.1 LED17.3-GND | 47.1,170 47.1,169.37 46.9,169.17 46.9,165.3 LED18.3-GND | 47.1,170 47.1,173.1 | 47.1,170 42.07,170 40.77,171.3 38.23,171.3 37.7,170.77 37.7,168.23 38.23,167.7 38.8,167.7 SW2.C | SW2.D 21.11,160.61 | CB1.2 29.6,149.3 32,149.3 34.46,149.3 35.16,150 38,150 38,150.25 CA1.2 | CC2.1 74.97,159.51 74.97,158.89 74.44,158.36 69.34,158.36 68.4,159.3 68.4,160.6 65.58,163.42 LED19.3-GND 65.15,166.3 63.5,167.95 63.5,169.59 65.15,171.24 LED20.3-GND 65.15,177.25 LED21.3-GND 73,185.1 73,187.57 73.53,188.1 75.17,188.1 76.82,186.45 LED22.3-GND 79.88,186.45 84.33,190.9 90.95,190.9 92,189.85 92,188.2 LED24.3-GND 94.55,184.82 96.2,183.17 96.2,181.53 | 96.2,181.53 95.67,181 93.43,181 92.9,181.53 92.9,181.9 LED23.3-GND | 101.67,175 99.43,175 98,176.43 98,179.73 96.2,181.53 | 101.67,175 102.2,175.53 102.2,177.17 100.55,178.82 LED25.3-GND | 101.67,175 101.67,173.53 102.1,173.1 | 102.1,173.1 LED26.3-GND | 102.1,170 102.1,169.37 101.9,169.17 101.9,165.3 LED27.3-GND
  Top 1: 102.1,170 102.1,173.1 | 102.1,170 97.07,170 95.77,171.3 93.23,171.3 92.7,170.77 92.7,168.23 93.23,167.7 93.8,167.7 SW3.C | SW3.D 76.11,160.61 | CB2.2 84.6,149.3 89.46,149.3 90.16,150 93,150 93,150.25 CA2.2 | CC3.1 74.97,104.51 74.97,103.89 74.44,103.36 69.34,103.36 68.4,104.3 68.4,105.6 65.58,108.42 LED28.3-GND 65.15,111.3 63.5,112.95 63.5,114.59 65.15,116.24 LED29.3-GND 65.15,122.25 LED30.3-GND 73,130.1 73,132.57 73.53,133.1 75.17,133.1 76.82,131.45 LED31.3-GND 79.88,131.45 84.33,135.9 87,135.9 90.95,135.9 92,134.85 92,133.2 LED33.3-GND 94.55,129.82 96.2,128.17 96.2,126.53 | 96.2,126.53 95.67,126 93.43,126 92.9,126.53 92.9,126.9 LED32.3-GND | 101.67,120 99.43,120 98,121.43 98,124.73 96.2,126.53 | 101.67,120 102.2,120.53 102.2,122.17 100.55,123.82 LED34.3-GND | 101.67,120 101.67,118.53 102.1,118.1 | 102.1,118.1 LED35.3-GND | 102.1,115 102.1,114.37 101.9,114.17 101.9,110.3 LED36.3-GND | 102.1,115 102.1,118.1 | 102.1,115 97.07,115 95.77,116.3 93.23,116.3 92.7,115.77 92.7,113.23 93.23,112.7 93.8,112.7 SW4.C | SW4.D 76.11,105.61 | CB3.2 84.6,94.3 86,94.3 89.46,94.3 90.16,95 93,95 93,95.25 CA3.2 | CC4.1 19.97,104.51 19.97,103.89 19.44,103.36 14.34,103.36 13.4,104.3 13.4,105.6 10.58,108.42 LED37.3-GND 10.15,111.3 8.5,112.95 8.5,114.59 10.15,116.24 LED38.3-GND 10.15,122.25 LED39.3-GND 18,130.1 18,132.57 18.53,133.1 20.17,133.1 21.82,131.45 LED40.3-GND 24.88,131.45 29.33,135.9 32,135.9 35.95,135.9 37,134.85 37,133.2 LED42.3-GND 39.55,129.82 41.2,128.17 41.2,126.53 | 41.2,126.53 40.67,126 38.43,126 37.9,126.53 37.9,126.9 LED41.3-GND
  Top 1: 46.67,120 44.43,120 43,121.43 43,124.73 41.2,126.53 | 46.67,120 47.2,120.53 47.2,122.17 45.55,123.82 LED43.3-GND | 46.67,120 46.67,118.53 47.1,118.1 | 47.1,118.1 LED44.3-GND | 47.1,115 47.1,114.37 46.9,114.17 46.9,110.3 LED45.3-GND | 47.1,115 47.1,118.1 | 47.1,115 42.07,115 40.77,116.3 38.23,116.3 37.7,115.77 37.7,113.23 38.23,112.7 38.8,112.7 SW5.C | SW5.D 21.11,105.61 | CB4.2 29.6,94.3 33,94.3 34.46,94.3 35.16,95 38,95 38,95.25 CA4.2 | CC6.1 19.97,49.51 19.97,48.89 19.44,48.36 14.34,48.36 13.4,49.3 13.4,50.6 10.58,53.42 LED55.3-GND 10.15,56.3 8.5,57.95 8.5,59.59 10.15,61.24 LED56.3-GND 10.15,67.25 LED57.3-GND 18,75.1 18,77.57 18.53,78.1 20.17,78.1 21.82,76.45 LED58.3-GND 24.88,76.45 29.33,80.9 33,80.9 35.95,80.9 37,79.85 37,78.2 LED60.3-GND 39.55,74.82 41.2,73.17 41.2,71.53 | 41.2,71.53 40.67,71 38.43,71 37.9,71.53 37.9,71.9 LED59.3-GND | 46.67,65 44.43,65 43,66.43 43,69.73 41.2,71.53 | 46.67,65 47.2,65.53 47.2,67.17 45.55,68.82 LED61.3-GND | 46.67,65 46.67,63.53 47.1,63.1 | 47.1,63.1 LED62.3-GND | 47.1,60 47.1,59.37 46.9,59.17 46.9,55.3 LED63.3-GND | 47.1,60 47.1,63.1 | 47.1,60 42.07,60 40.77,61.3 38.23,61.3 37.7,60.77 37.7,58.23 38.23,57.7 38.8,57.7 SW7.C | SW7.D 21.11,50.61 | CB6.2 29.6,39.3 34.46,39.3 35.16,40 38,40 38,40.25 CA6.2 | CC8.1 74.97,49.51 74.97,48.89 74.44,48.36 69.34,48.36 68.4,49.3 68.4,50.6 65.58,53.42 LED73.3-GND 65.15,56.3 63.5,57.95 63.5,59.59 65.15,61.24 LED74.3-GND 65.15,67.25 LED75.3-GND 73,75.1 73,77.57 73.53,78.1 75.17,78.1 76.82,76.45 LED76.3-GND 79.88,76.45 84.33,80.9 86,80.9 90.95,80.9 92,79.85 92,78.2 LED78.3-GND 94.55,74.82 96.2,73.17 96.2,71.53
  Top 1: 96.2,71.53 95.67,71 93.43,71 92.9,71.53 92.9,71.9 LED77.3-GND | 101.67,65 99.43,65 98,66.43 98,69.73 96.2,71.53 | 101.67,65 102.2,65.53 102.2,67.17 100.55,68.82 LED79.3-GND | 101.67,65 101.67,63.53 102.1,63.1 | 102.1,63.1 LED80.3-GND | 102.1,60 102.1,59.37 101.9,59.17 101.9,55.3 LED81.3-GND | 102.1,60 102.1,63.1 | 102.1,60 97.07,60 95.77,61.3 93.23,61.3 92.7,60.77 92.7,58.23 93.23,57.7 93.8,57.7 SW9.C | SW9.D 76.11,50.61 | CB8.2 84.6,39.3 87,39.3 | 87,39.3 89.46,39.3 90.16,40 93,40 93,40.25 CA8.2 | 87,39.3 v87,36 | 33,89 v30,89
  Top 1.5: 35.95,190.9 84.33,190.9 | 88,148.85 87,148.85 87,135.9 | 33,94.3 33,89 33,80.9 | 86,94.3 86,90 86,86 86,80.9 | 32,149.3 32,135.9
  Bottom 0.6: v66,100 75.5,109.5 76,109.5 SW4.D 80,92 v82,90 | TP4.TP 4.9,16.34 4.9,21.16 5.84,22.1 11.97,22.1 13.07,21 13.07,20.58 U$2.GND1 14.01,29.38 | 14.01,29.38 18.15,33.52 18.15,33.94 U$2.GND2 20.03,35.82 20.03,36.24 20.97,37.18 24.18,37.18 v26,39 | SW7.D 20.05,49.55 19.09,49.55 9.87,40.33 9.87,33.52 14.01,29.38
  Bottom 1: v87,36 80,43 SW9.D | 11.6,97.51 14.76,94.35 24.65,94.35 v30,89 | SW5.D 27,111.5 27,115.86 26.36,116.5 23.64,116.5 21.07,113.93 | 11.6,97.51 11.6,104.46 21.07,113.93 | 21.07,113.93 21.07,155.28 26.05,160.25 26.05,161.75 25,162.8 SW2.D 31.95,164.5 34.25,166.8 35.75,166.8 36.27,166.27 | 36.27,166.27 36.8,165.75 36.8,163.84 38.14,162.5 40.86,162.5 49.86,171.5 81.36,171.5 82,170.86 82,168.14 80,166.14 SW3.D | SW2.C 37,167 36.27,166.27 | 76,109.5 69.9,115.6 69.9,117.15 65,122.05 v65,144 v52,144 | 11.6,97.51 9,94.91 v9,94
  pour Top: 0,5 0,193 111,193 128,193 128,0 0,0
  pour Bottom: 0,0 0,193 128,193 128,0
I2C_CLK  (via drill 0.6)
  Top 0.6: U$2.D1 11.25,34.75 11.25,33.25 4.75,26.75 4.75,17.25 5.25,16.75 5.25,12.75 6.5,11.5 15.25,11.5 17.25,13.5 17.25,14.5 TP1.TP | v61,77 63.82,79.82 65.38,79.82 66,80.44 66,81.48 65.93,81.55 65.93,81.58 66,81.58 65.99,81.57 IC1.12
  Bottom 0.6: v61,77 41.3,57.3 41.3,53.23 36.42,48.35 19.59,48.35 12.41,41.17 12.41,35.82 U$2.D1
I2C_DATA  (via drill 0.6)
  Top 0.6: v41,66.25 21.75,47 21.75,45.75 14.25,38.25 14.25,35 U$2.D0 13.75,34.75 13.75,34 6.5,26.75 v6.5,20.5 | 67.25,81.5 IC1.13 67.22,79.97 61.51,74.25 v49,74.25
  Bottom 0.6: v41,66.25 v49,74.25 | v6.5,20.5 12.25,14.75 14.25,14.75 TP2.TP
N$6
  Top 0.5: LED10.2-DOUT 10.15,168.32 LED11.4-DIN
N$11
  Top 0.5: LED11.2-DOUT 15.05,173.85 LED12.4-DIN
N$12
  Top 0.5: LED12.2-DOUT 18.25,180.45 18.25,182.57 19.35,183.67 LED13.4-DIN
N$13
  Top 0.5: LED14.4-DIN 30.95,185.15 30.95,184.63 27.87,181.55 LED13.2-DOUT
N$16
  Top 0.5: SW2.A 39.5,160.56 R_DISB1.1
N$17
  Top 0.5: SW2.B 40.45,168.55 40.67,168.55 41.05,168.17 41.05,163.42 49,155.47 49,153.33 48.62,152.95 48.35,152.95 R_DISA1.1
N$18
  Top 0.6: LED17.2-DOUT 53.45,171.16 50.4,168.11 50.4,162.2 LED18.4-DIN
N$19
  Top 0.5: LED16.2-DOUT 50.45,178.47 51.85,177.07 51.85,171.65 LED17.4-DIN
N$20
  Top 0.5: LED15.2-DOUT 44.45,184.47 45.85,183.07 45.85,181.63 45.47,181.25 45.03,181.25 44.15,180.37 44.15,177.75 LED16.4-DIN
N$21
  Top 0.5: LED15.4-DIN 35.85,186.05 35.85,189.37 35.47,189.75 33.43,189.75 33.05,189.37 33.05,188.85 LED14.2-DOUT
N$22
  Top 0.5: LED19.2-DOUT 65.15,168.32 LED20.4-DIN
N$23
  Top 0.5: LED20.2-DOUT 70.05,173.85 LED21.4-DIN
N$24
  Top 0.5: LED21.2-DOUT 73.25,180.45 73.25,182.57 74.35,183.67 LED22.4-DIN
N$25
  Top 0.5: LED23.4-DIN 85.95,185.15 85.95,184.63 82.87,181.55 LED22.2-DOUT
N$26
  Top 0.5: SW3.A 94.5,160.56 R_DISB2.1
N$27
  Top 0.5: SW3.B 95.45,168.55 95.67,168.55 96.05,168.17 96.05,163.42 104,155.47 104,153.33 103.62,152.95 103.35,152.95 R_DISA2.1
N$28
  Top 0.6: LED26.2-DOUT 108.45,171.16 105.4,168.11 105.4,162.2 LED27.4-DIN
N$29
  Top 0.5: LED25.2-DOUT 105.45,178.47 106.85,177.07 106.85,171.65 LED26.4-DIN
N$30
  Top 0.5: LED24.2-DOUT 99.45,184.47 100.85,183.07 100.85,181.63 100.47,181.25 100.03,181.25 99.15,180.37 99.15,177.75 LED25.4-DIN
N$31
  Top 0.5: LED24.4-DIN 90.85,186.05 90.85,189.37 90.47,189.75 88.43,189.75 88.05,189.37 88.05,188.85 LED23.2-DOUT
N$32
  Top 0.5: LED28.2-DOUT 65.15,113.32 LED29.4-DIN
N$33
  Top 0.5: LED29.2-DOUT 70.05,118.85 LED30.4-DIN
N$34
  Top 0.5: LED30.2-DOUT 73.25,125.45 73.25,127.57 74.35,128.67 LED31.4-DIN
N$35
  Top 0.5: LED32.4-DIN 85.95,130.15 85.95,129.63 82.87,126.55 LED31.2-DOUT
N$36
  Top 0.5: SW4.A 94.5,105.56 R_DISB3.1
N$37
  Top 0.5: SW4.B 95.45,113.55 95.67,113.55 96.05,113.17 96.05,108.42 104,100.47 104,98.33 103.62,97.95 103.35,97.95 R_DISA3.1
N$38
  Top 0.61: 108,116.17 105.2,113.37 105.2,107.83 103.55,106.18
  Top 1: LED35.2-DOUT 108,116.2 108,116.17 | 103.55,106.18 LED36.4-DIN
N$39
  Top 0.5: LED34.2-DOUT 105.45,123.47 106.85,122.07 106.85,116.65 LED35.4-DIN
N$40
  Top 0.5: LED33.2-DOUT 99.45,129.47 100.85,128.07 100.85,126.63 100.47,126.25 100.03,126.25 99.15,125.37 99.15,122.75 LED34.4-DIN
N$41
  Top 0.5: LED33.4-DIN 90.85,131.05 90.85,134.37 90.47,134.75 88.43,134.75 88.05,134.37 88.05,133.85 LED32.2-DOUT
N$42
  Top 0.5: LED37.2-DOUT 10.15,113.32 LED38.4-DIN
N$43
  Top 0.5: LED38.2-DOUT 15.05,118.85 LED39.4-DIN
N$44
  Top 0.5: LED39.2-DOUT 18.25,125.45 18.25,127.57 19.35,128.67 LED40.4-DIN
N$45
  Top 0.5: LED41.4-DIN 30.95,130.15 30.95,129.63 27.87,126.55 LED40.2-DOUT
N$46
  Top 0.5: SW5.A 39.5,105.56 R_DISB4.1
N$47
  Top 0.5: SW5.B 40.45,113.55 40.67,113.55 41.05,113.17 41.05,108.42 49,100.47 49,98.33 48.62,97.95 48.35,97.95 R_DISA4.1
N$48
  Top 0.61: 53,116.17 50.2,113.37 50.2,107.83 48.55,106.18
  Top 1: LED44.2-DOUT 53,116.2 53,116.17 | 48.55,106.18 LED45.4-DIN
N$49
  Top 0.5: LED43.2-DOUT 50.45,123.47 51.85,122.07 51.85,116.65 LED44.4-DIN
N$50
  Top 0.5: LED42.2-DOUT 44.45,129.47 45.85,128.07 45.85,126.63 45.47,126.25 45.03,126.25 44.15,125.37 44.15,122.75 LED43.4-DIN
N$51
  Top 0.5: LED42.4-DIN 35.85,131.05 35.85,134.37 35.47,134.75 33.43,134.75 33.05,134.37 33.05,133.85 LED41.2-DOUT
N$62
  Top 0.5: LED55.2-DOUT 10.15,58.32 LED56.4-DIN
N$63
  Top 0.5: LED56.2-DOUT 15.05,63.85 LED57.4-DIN
N$64
  Top 0.5: LED57.2-DOUT 18.25,70.45 18.25,72.57 19.35,73.67 LED58.4-DIN
N$65
  Top 0.5: LED59.4-DIN 30.95,75.15 30.95,74.63 27.87,71.55 LED58.2-DOUT
N$66
  Top 0.5: SW7.A 39.5,50.56 R_DISB6.1
N$67
  Top 0.5: SW7.B 40.45,58.55 40.67,58.55 41.05,58.17 41.05,53.42 49,45.47 49,43.33 48.62,42.95 48.35,42.95 R_DISA6.1
N$68
  Top 0.61: 53,61.17 50.2,58.37 50.2,52.83 48.55,51.18
  Top 1: LED62.2-DOUT 53,61.2 53,61.17 | 48.55,51.18 LED63.4-DIN
N$69
  Top 0.5: LED61.2-DOUT 50.45,68.47 51.85,67.07 51.85,61.65 LED62.4-DIN
N$70
  Top 0.5: LED60.2-DOUT 44.45,74.47 45.85,73.07 45.85,71.63 45.47,71.25 45.03,71.25 44.15,70.37 44.15,67.75 LED61.4-DIN
N$71
  Top 0.5: LED60.4-DIN 35.85,76.05 35.85,79.37 35.47,79.75 33.43,79.75 33.05,79.37 33.05,78.85 LED59.2-DOUT
N$82
  Top 0.5: LED73.2-DOUT 65.15,58.32 LED74.4-DIN
N$83
  Top 0.5: LED74.2-DOUT 70.05,63.85 LED75.4-DIN
N$84
  Top 0.5: LED75.2-DOUT 73.25,70.45 73.25,72.57 74.35,73.67 LED76.4-DIN
N$85
  Top 0.5: LED77.4-DIN 85.95,75.15 85.95,74.63 82.87,71.55 LED76.2-DOUT
N$86
  Top 0.5: SW9.A 94.5,50.56 R_DISB8.1
N$87
  Top 0.5: SW9.B 95.45,58.55 95.67,58.55 96.05,58.17 96.05,53.42 104,45.47 104,43.33 103.62,42.95 103.35,42.95 R_DISA8.1
N$88
  Top 0.61: 108,61.17 105.2,58.37 105.2,52.83 103.55,51.18
  Top 1: LED80.2-DOUT 108,61.2 108,61.17 | 103.55,51.18 LED81.4-DIN
N$89
  Top 0.5: LED79.2-DOUT 105.45,68.47 106.85,67.07 106.85,61.65 LED80.4-DIN
N$90
  Top 0.5: LED78.2-DOUT 99.45,74.47 100.85,73.07 100.85,71.63 100.47,71.25 100.03,71.25 99.15,70.37 99.15,67.75 LED79.4-DIN
N$91
  Top 0.5: LED78.4-DIN 90.85,76.05 90.85,79.37 90.47,79.75 88.43,79.75 88.05,79.37 88.05,78.85 LED77.2-DOUT
NEOPIXEL_IN  (via drill 0.6)
  Top 0.6: v20,46.5 11.25,46.5 5.75,52 5.75,143.5 10,147.75 10,160 LED10.4-DIN
  Bottom 0.6: 32,36 32,35 U$2.D6 30.85,35.82 30.85,36.24 30.05,37.05 29.91,37.18 27.6,39.49 27.6,39.66 20.76,46.5 v20,46.5
PIXEL_1
  Top 0.6: LED18.2-DOUT 53.5,163.5 61.75,163.5 65,160.25 LED19.4-DIN
PIXEL_2  (via drill 0.6)
  Top 0.6: v96,122 75.75,101.75 68.5,101.75 65.25,105 LED28.4-DIN | v104,130 104,136.5 111.75,144.25 111.75,160.25 108.5,163.5 LED27.2-DOUT
  Bottom 0.6: v104,130 v96,122
PIXEL_3  (via drill 0.6)
  Top 0.6: v18.75,101.5 13.75,101.5 10.25,105 LED37.4-DIN | 110.25,106.75 110,107 108.5,108.5 LED36.2-DOUT
  Top 1: v94,89 96,87 v96,84 | 110,107 112,105 v112,100
  Bottom 0.6: v18.75,101.5 19.3,100.95 36,100.95 40.35,96.6 70.66,96.6 72.35,94.91 72.35,93.65 74,92 74,86 93.32,86
  Bottom 1: 93.32,86 94,86.68 v94,89 | v96,84 v112,100
PIXEL_4  (via drill 0.6)
  Top 0.6: v45,117.75 37.5,117.75 7,87.25 7,54 10,51 10,50.25 LED55.4-DIN | v55.25,110.5 53.5,108.75 LED45.2-DOUT
  Bottom 0.6: v45,117.75 48,117.75 v55.25,110.5
PIXEL_5
  Top 0.6: LED63.2-DOUT 53.5,53.5 61.75,53.5 65,50.25 LED73.4-DIN
ROT1_1  (via drill 0.6)
  Top 0.5: R_DISA1.2 43.39,154.4 R_PDA1.1 40,153.8 37.2,153.8 37,154 37.05,154 CA1.1
  Top 0.6: 40,153.8 40,143 v42,141 | IC1.21 60.91,91.17 60.91,92.35 62,93.44 v62,95
  Bottom 0.6: v42,141 42,108.93 36.17,103.1 18.09,103.1 15.4,100.41 15.4,99.09 16.34,98.15 34.84,98.15 45.59,87.4 46.91,87.4 47.85,88.34 47.85,89.86 53.09,95.1 61.9,95.1 v62,95
ROT1_2  (via drill 0.6)
  Top 0.5: R_DISA2.2 98.39,154.4 R_PDA2.1 95.25,153.8 92.2,153.8 92,154 92.05,154 CA2.1
  Top 0.6: v55.75,79.25 54,77.5 52.5,77.5 51.5,78.5 51.5,79.75 51.75,80 51.75,81.5 IC1.1 | v70.75,94.25 70.75,94.75 90.25,114.25 v90.75,114.25 | 95.25,153.8 v95.25,132.5
  Bottom 0.6: v90.75,114.25 90.75,128 v95.25,132.5 | v55.75,79.25 55.75,87.75 61.4,93.4 62.66,93.4 63.51,94.25 v70.75,94.25
ROT1_3
  Top 0.5: R_DISA3.2 98.39,99.4 R_PDA3.1 92.2,98.8 92,99 92.05,99 CA3.1
ROT1_4
  Top 0.5: R_DISA4.2 43.39,99.4 R_PDA4.1 37.2,98.8 37,99 37.05,99 CA4.1
ROT1_5
  Top 0.5: R_DISA6.2 43.39,44.4 R_PDA6.1 37.2,43.8 37,44 37.05,44 CA6.1
ROT1_6
  Top 0.5: R_DISA8.2 98.39,44.4 R_PDA8.1 92.2,43.8 92,44 92.05,44 CA8.1
ROT2_1  (via drill 0.6)
  Top 0.5: R_DISB1.2 30.97,151 29.76,152.21 29.49,152.21 CB1.1 27.9,153.8 R_PUB1.1
  Top 0.6: R_DISB1.2 34,151 32.9,152.1 31.02,152.1 30.49,152.63 30.49,154.97 31.02,155.5 31.17,155.5 35,159.33 v35,165 | v50,87 50.8,87.8 57.45,87.8 59.55,89.91 59.55,91.08 IC1.22
  Bottom 0.6: v35,165 35,139.51 35.85,138.66 35.85,117.28 22.87,104.3 17.59,104.3 14.2,100.91 14.2,98.59 15.84,96.95 34.34,96.95 45.09,86.2 47.41,86.2 48.21,87 v50,87
ROT2_2  (via drill 0.6)
  Top 0.5: R_DISB2.2 85.97,151 84.76,152.21 84.49,152.21 CB2.1 82.9,153.8 80.75,153.8 R_PUB2.1
  Top 0.6: v53.25,79.25 IC1.2 | v63.75,103.5 v53.75,93.5 | v63.25,121.25 63.25,132.25 80.75,149.75 80.75,153.8
  Bottom 0.6: v53.25,79.25 53.25,93 v53.75,93.5 | v63.75,103.5 63.75,109.75 68.5,114.5 68.5,116 v63.25,121.25
ROT2_3
  Top 0.5: R_DISB3.2 85.97,96 84.76,97.21 84.49,97.21 CB3.1 82.9,98.8 R_PUB3.1
ROT2_4
  Top 0.5: R_DISB4.2 30.97,96 29.76,97.21 29.49,97.21 CB4.1 27.9,98.8 R_PUB4.1
ROT2_5
  Top 0.5: R_DISB6.2 30.97,41 29.76,42.21 29.49,42.21 CB6.1 27.9,43.8 R_PUB6.1
ROT2_6
  Top 0.5: R_DISB8.2 85.97,41 84.76,42.21 84.49,42.21 CB8.1 82.9,43.8 R_PUB8.1
VCC  (via drill 0.6)
  Top 0.4: 18,176.35 LED12.1-VDD | 14.7,168.77 LED11.1-VDD | 24,150.44 R_PUB1.2 | 73,176.35 LED21.1-VDD | 69.7,168.77 LED20.1-VDD | 79,150.44 R_PUB2.2 | 73,121.35 LED30.1-VDD | 69.7,113.77 LED29.1-VDD | 18,121.35 LED39.1-VDD | 14.7,113.77 LED38.1-VDD | 24,95.44 R_PUB4.2 | 18,66.35 LED57.1-VDD | 14.7,58.77 LED56.1-VDD | 73,66.35 LED75.1-VDD | 69.7,58.77 LED74.1-VDD | 79,40.44 78.72,40.72 R_PUB8.2
  Top 0.6: LED13.1-VDD 19.5,181.75 19.4,181.55 | LED40.1-VDD 19.5,126.75 19.4,126.55 | 25.25,148.75 25.25,149 24,150.25 R_PUB1.2 | 25.25,148.75 v25.25,134.75 | v28,132 27.95,132.05 | 19.4,177.75 19.75,177.5 20.25,177.5 27,170.75 27,161 21,155 21,152.75 25,148.75 25.25,148.75 | LED31.1-VDD 74.5,126.75 74.4,126.55 | v66.75,115.25 67,115 69.75,115 70.05,114.6 | v63.25,118.75 60,118.75 57.75,116.5 55.1,116.5 | LED22.1-VDD 74.5,181.75 74.4,181.55 | R_PUB2.2 77.75,151 | 45.75,132.25 45.57,132 | LED76.1-VDD 74.5,71.75 74.4,71.55 | 75.25,67.5 74.75,67.5 74.4,67.75 | 77.75,41 R_PUB8.2 79,40.25 80,40.25 | 98,77.25 98.33,77 | 108.25,105 108.44,105.32 LED36.1-VDD | 97.25,40.5 R_PDA8.2 | LED58.1-VDD 19.5,71.75 19.4,71.55 | v28,77 27.95,77.05 | R_PDA6.2 42.25,40.5 38.93,37.18 26.05,37.18 25.44,36.57 24.83,37.18 24.82,37.18 24,38 24,40.44 R_PUB6.2 | TP3.TP 7.5,14.75 7.5,18.75 10.75,22 19.5,22 19.95,21.56 | 44,77.45 44,77 | 52.75,48.75 52.3,49.2 | LED45.1-VDD 53.25,105 53.25,104.25 50.25,101.25 50.25,96.25 44.5,90.5 44,90.5 | 60.74,87 62,87 62.14,86.86 IC1.9
  Top 1: LED18.1-VDD 53.45,161.18 51.8,162.83 51.8,164.47 53.45,166.12 LED17.1-VDD 53.45,169.18 55.1,170.83 55.1,177.47 51.57,181 49.33,181 | 49.33,181 48.8,180.47 48.8,178.49 50.45,176.84 LED16.1-VDD | 49.33,181 47,183.33 47,185.57 45.57,187 43.33,187 42.8,186.47 42.8,184.49 44.45,182.84 LED15.1-VDD | LED14.1-VDD 24.1,183.2 21.83,183.2 20.18,181.55 19.4,181.55 | 19.4,182 19.4,181.55 | 19.4,181.55 19.4,177.75 18,176.35 | LED12.1-VDD 16.7,175.6 16.7,172 | 16.7,172 16.7,171.25 15.05,169.6 LED11.1-VDD 15.05,165.89 16.7,164.24 16.7,162.6 15.05,160.95 LED10.1-VDD | 16.7,172 18.91,172 R_PUC1.2 | LED27.1-VDD 108.45,161.18 106.8,162.83 106.8,164.47 108.45,166.12 LED26.1-VDD 108.45,169.18 110.1,170.83 110.1,177.47 106.57,181 104.33,181 | 104.33,181 103.8,180.47 103.8,178.49 105.45,176.84 LED25.1-VDD | 104.33,181 102,183.33 102,185.57 100.57,187 98.33,187 97.8,186.47 97.8,184.49 99.45,182.84 LED24.1-VDD | LED23.1-VDD 79.1,183.2 76.83,183.2 75.18,181.55 74.4,181.55 | 74.4,182 74.4,181.55 | 74.4,181.55 74.4,177.75 73,176.35 | LED21.1-VDD 71.7,175.6 71.7,172 | 71.7,172 71.7,171.25 70.05,169.6 LED20.1-VDD 70.05,165.89 71.7,164.24 71.7,162.6 70.05,160.95 LED19.1-VDD | 71.7,172 73.91,172 R_PUC2.2 | LED36.1-VDD 108.45,106.18 106.8,107.83 106.8,109.47 108.45,111.12 LED35.1-VDD 108.45,114.18 110.1,115.83 110.1,122.47 106.57,126 104.33,126 | 104.33,126 103.8,125.47 103.8,123.49 105.45,121.84 LED34.1-VDD | 104.33,126 102,128.33 102,130.57 100.57,132 98.33,132 97.8,131.47 97.8,129.49 99.45,127.84 LED33.1-VDD | LED32.1-VDD 79.1,128.2 76.83,128.2 75.18,126.55 74.4,126.55
  Top 1: 74.4,127 74.4,126.55 | 74.4,126.55 74.4,122.75 73,121.35 | LED30.1-VDD 71.7,120.6 71.7,117 | 71.7,117 71.7,116.25 70.05,114.6 LED29.1-VDD 70.05,110.89 71.7,109.24 71.7,107.6 70.05,105.95 LED28.1-VDD | 71.7,117 73.91,117 R_PUC3.2 | LED45.1-VDD 53.45,106.18 51.8,107.83 51.8,109.47 53.45,111.12 LED44.1-VDD 53.45,114.18 55.1,115.83 55.1,116.5 55.1,122.47 51.57,126 49.33,126 | 49.33,126 48.8,125.47 48.8,123.49 50.45,121.84 LED43.1-VDD | 45.57,132 43.33,132 42.8,131.47 42.8,129.49 44.45,127.84 LED42.1-VDD | 49.33,126 47,128.33 47,130.57 45.57,132 | LED41.1-VDD 27.95,132.05 24.1,128.2 21.83,128.2 20.18,126.55 19.4,126.55 | 19.4,127 19.4,126.55 | 19.4,126.55 19.4,122.75 18,121.35 | LED39.1-VDD 16.7,120.6 16.7,117 | 16.7,117 16.7,116.25 15.05,114.6 LED38.1-VDD 15.05,110.89 16.7,109.24 16.7,107.6 15.05,105.95 LED37.1-VDD | 16.7,117 18.91,117 R_PUC4.2 | 49.33,71 51.57,71 55.1,67.47 55.1,60.83 53.45,59.18 LED62.1-VDD 53.45,56.12 51.8,54.47 51.8,52.83 53.45,51.18 LED63.1-VDD 62.16,50.35 65.75,46.76 73.23,46.76 75.99,44 | 49.33,71 48.8,70.47 48.8,68.49 50.45,66.84 LED61.1-VDD | 49.33,71 47,73.33 47,75.57 45.57,77 44,77 43.33,77 42.8,76.47 42.8,74.49 44.45,72.84 LED60.1-VDD | LED59.1-VDD 27.95,77.05 24.1,73.2 21.83,73.2 20.18,71.55 19.4,71.55 | 19.4,72 19.4,71.55 | 19.4,71.55 19.4,67.75 18,66.35 | LED57.1-VDD 16.7,65.6 16.7,62 | 16.7,62 16.7,61.25 15.05,59.6 LED56.1-VDD 15.05,55.89 16.7,54.24 16.7,52.6 15.05,50.95 LED55.1-VDD | 16.7,62 18.91,62 R_PUC6.2 | LED81.1-VDD 108.45,51.18 106.8,52.83 106.8,54.47 108.45,56.12 LED80.1-VDD 108.45,59.18 110.1,60.83 110.1,67.47 106.57,71 104.33,71
  Top 1: 104.33,71 103.8,70.47 103.8,68.49 105.45,66.84 LED79.1-VDD | 99,77 100.57,77 102,75.57 102,73.33 104.33,71 | 99,77 98.33,77 97.8,76.47 97.8,74.49 99.45,72.84 LED78.1-VDD | LED77.1-VDD 79.1,73.2 76.83,73.2 75.18,71.55 74.4,71.55 | 74.4,72 74.4,71.55 | 74.4,71.55 74.4,67.75 73,66.35 | LED75.1-VDD 71.7,65.6 71.7,62 | 71.7,62 71.7,61.25 70.05,59.6 LED74.1-VDD 70.05,55.89 71.7,54.24 71.7,52.6 70.05,50.95 LED73.1-VDD | 71.7,62 73.91,62 R_PUC8.2 | 78.72,40.72 79.47,40.72 85.99,34.2 90.99,34.2 R_PDA8.2 | 75.99,44 75.99,42.54 76.63,41.9 77.54,41.9 R_PUB8.2 | 75.99,44 75.99,45.06 82,51.07 82,60.86 78.5,64.36 77.89,64.36 74.75,67.5 | R_PUB3.2 69.3,86.86 62.14,86.86 58.49,86.86 56.83,85.2 45.2,85.2 44,84 | 44,83 36.25,83 v35.25,84 | v25.25,79.75 25.25,94.19 R_PUB4.2 | 45.57,132 45.09,132.48 45.09,138 | 45.09,138 45.09,149.45 | v34.25,138 45.09,138 | 73,156.51 75.99,153.52 75.99,152.54 76.63,151.9 77.54,151.9 R_PUB2.2 | 99,77 97.79,78.21 97.79,91 | 97.79,91 R_PDA3.2 | 97.79,91 101.49,94.7 103.81,94.7 108.44,99.33 108.44,105.32
  Top 1.5: 56,157 65.16,157 65.65,156.51 73,156.51 76.03,156.51 82.25,162.73 82.25,170.96 78.6,174.61 77.54,174.61 74.4,177.75 | 56,157 55,157 53.45,158.55 LED18.1-VDD | 100.57,132 100.57,135.57 108,143 | 108,143 110,145 110,158.8 LED27.1-VDD | R_PDA2.2 105.79,143 108,143 | R_PDA1.2 43.54,151 45.09,149.45 48.91,149.45 49.7,150.24 49.7,150.7 56,157 | R_PDA4.2 44,94.79 44,90.5 44,84 44,83 44,77.45 | 48.91,39.45 45.09,39.45 43.54,41 R_PDA6.2 | LED63.1-VDD 52.3,49.2 50.6,47.5 50.6,41.14 48.91,39.45 | R_PDA8.2 98.54,41 100.09,39.45 103.91,39.45 105.6,41.14 105.6,47.5 LED81.1-VDD | U$2.+5V 19.58,20.13 19.58,21.19 19.95,21.56 28.39,30 52,30 52,36.36 48.91,39.45
  Bottom 0.6: v25.25,134.75 v28,132 28.25,132 v34.25,138 | v63.25,118.75 v66.75,115.25
  Bottom 1: v25.25,79.75 v28,77 | v28,77 28.25,77 | v28,77 35,84 v35.25,84